# EAGLE design Adafruit Circuit Playground Bluefruit (EAGLE 9.5.0)

## Sheet 1 of 3
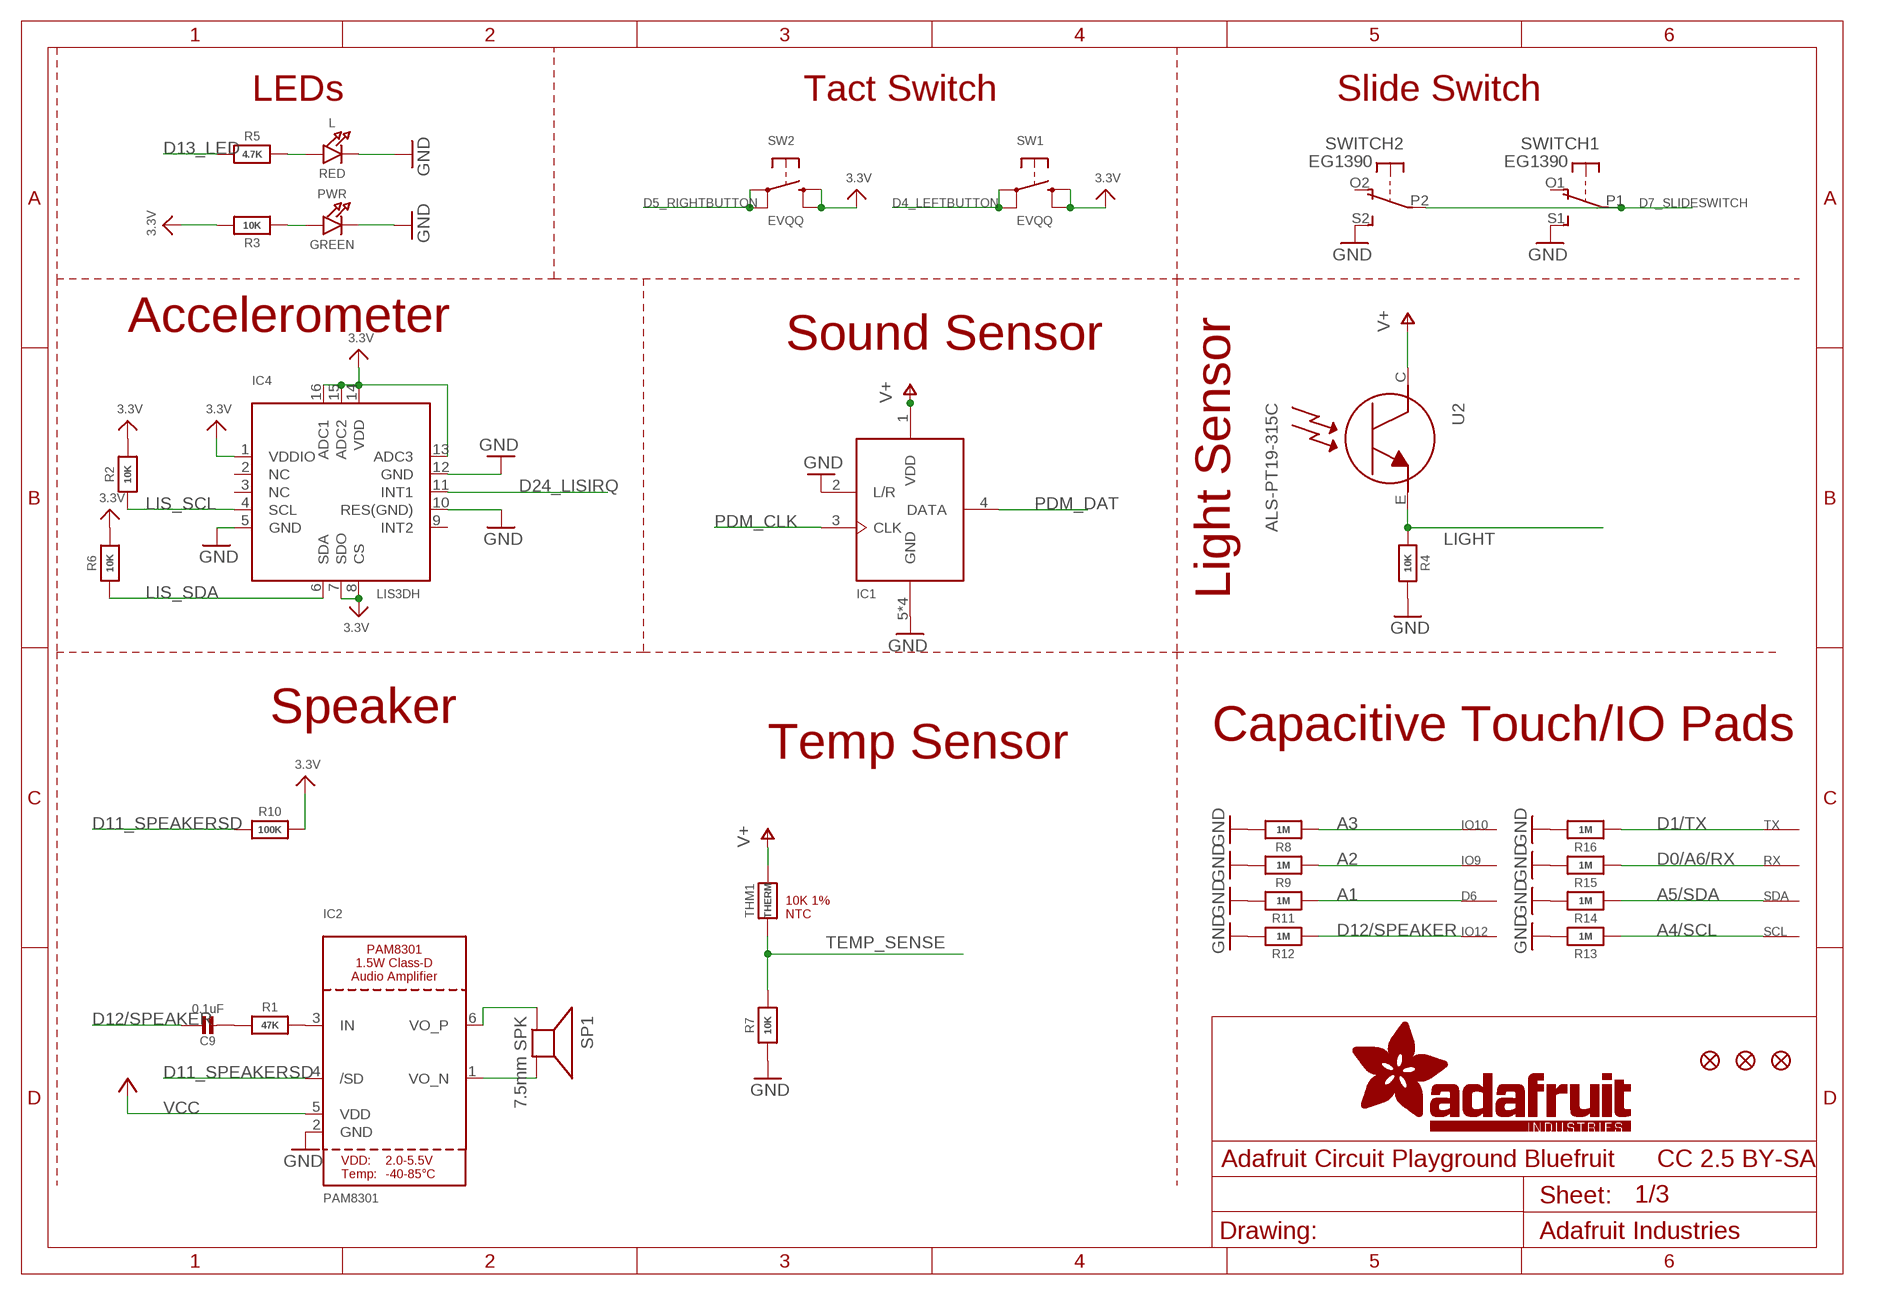
[diagram p0: schematic, sheet 1]

### Parts
C9  0.1uF  CAP_CERAMIC0603_NO  [0603-NO]
D6  SEWTAP-ALLIGATOR  [SEWALLI]
IC1  MIC_PDM  MIC_PDM_SPK0415  [SPK0415HM4H]
IC2  PAM8301  [SOT23-6]
IC4  LIS3DH  ACCEL_LIS3DHTR  [LGA16_3X3MM]
IO9  SEWTAP-ALLIGATOR  [SEWALLI]
IO10  SEWTAP-ALLIGATOR  [SEWALLI]
IO12  SEWTAP-ALLIGATOR  [SEWALLI]
L  RED  LED0603_NOOUTLINE  [CHIPLED_0603_NOOUTLINE]
PWR  GREEN  LED0603_NOOUTLINE  [CHIPLED_0603_NOOUTLINE]
R1  47K  RESISTOR_0603_NOOUT  [0603-NO]
R2  10K  RESISTOR_0603_NOOUT  [0603-NO]
R3  10K  RESISTOR_0603_NOOUT  [0603-NO]
R4  10K  RESISTOR_0603_NOOUT  [0603-NO]
R5  4.7K  RESISTOR_0603_NOOUT  [0603-NO]
R6  10K  RESISTOR_0603_NOOUT  [0603-NO]
R7  10K  RESISTOR_0603_NOOUT  [0603-NO]
R8  1M  RESISTOR_0603_NOOUT  [0603-NO]
R9  1M  RESISTOR_0603_NOOUT  [0603-NO]
R10  100K  RESISTOR_0603_NOOUT  [0603-NO]
R11  1M  RESISTOR_0603_NOOUT  [0603-NO]
R12  1M  RESISTOR_0603_NOOUT  [0603-NO]
R13  1M  RESISTOR_0603_NOOUT  [0603-NO]
R14  1M  RESISTOR_0603_NOOUT  [0603-NO]
R15  1M  RESISTOR_0603_NOOUT  [0603-NO]
R16  1M  RESISTOR_0603_NOOUT  [0603-NO]
RX  SEWTAP-ALLIGATOR  [SEWALLI]
SCL  SEWTAP-ALLIGATOR  [SEWALLI]
SDA  SEWTAP-ALLIGATOR  [SEWALLI]
SP1  7.5mm SPK  SPEAKER_7.5MM  [BUZZER_SMT_7.5MM]
SW1  EVQQ  SWITCH_TACT_SMT_EVQQ2_SMALL  [EVQ-Q2_SMALLER]
SW2  EVQQ  SWITCH_TACT_SMT_EVQQ2_SMALL  [EVQ-Q2_SMALLER]
SWITCH  EG1390  DPDT-EG1390  [EG1390]
THM1  THERM  RESISTOR_0402  [_0402]
TX  SEWTAP-ALLIGATOR  [SEWALLI]
U2  ALS-PT19-315C  PHOTOTRANSISTOR_PT19-315C  [ALS-PT19-315C]
U$2  FIDUCIAL_1MM  [FIDUCIAL_1MM]
U$3  FIDUCIAL_1MM  [FIDUCIAL_1MM]
U$6  FIDUCIAL_1MM  [FIDUCIAL_1MM]

### Nets
3.3V [power]: IC4.1(VDDIO) IC4.7(SDO) IC4.8(CS) IC4.13(ADC3) IC4.14(VDD) IC4.15(ADC2) IC4.16(ADC1) R2.2 R3.2 R6.2 R10.2 SW1.B'(S1) SW1.B(S) SW2.B'(S1) SW2.B(S) ; also sheet 2,3
A1: D6.P$1(SEW) R11.1 ; also sheet 2
A2: IO9.P$1(SEW) R9.1 ; also sheet 2
A3: IO10.P$1(SEW) R8.1 ; also sheet 2
A4/SCL: R13.1 SCL.P$1(SEW) ; also sheet 2
A5/SDA: R14.1 SDA.P$1(SEW) ; also sheet 2
D0/A6/RX: R15.1 RX.P$1(SEW) ; also sheet 2
D1/TX: R16.1 TX.P$1(SEW) ; also sheet 2
D4_LEFTBUTTON: SW1.A'(P1) SW1.A(P) ; also sheet 2
D5_RIGHTBUTTON: SW2.A'(P1) SW2.A(P) ; also sheet 2
D7_SLIDESWITCH: SWITCH.P1(1:P) SWITCH.P2(2:P) ; also sheet 2
D11_SPEAKERSD: IC2.4(/SD) R10.1 ; also sheet 2
D12/SPEAKER: C9.1 IO12.P$1(SEW) R12.1 ; also sheet 2
D13_LED: R5.1 ; also sheet 2
D24_LISIRQ: IC4.11(INT1) ; also sheet 2
GND [power]: IC1.2(L/R) IC1.5(GND) IC1.6(GND) IC1.7(GND) IC1.8(GND) IC2.2(GND) IC4.5(GND) IC4.10(RES(GND)) IC4.12(GND) L.C PWR.C R4.1 R7.1 R8.2 R9.2 R11.2 R12.2 R13.2 R14.2 R15.2 R16.2 SWITCH.S1(1:S) SWITCH.S2(2:S) ; also sheet 2,3
LIGHT: R4.2 U2.E ; also sheet 2
LIS_SCL: IC4.4(SCL) R2.1 ; also sheet 2
LIS_SDA: IC4.6(SDA) R6.1 ; also sheet 2
N$1: PWR.A R3.1
N$6: C9.2 R1.1
N$8: IC2.3(IN) R1.2
N$9: IC2.6(VO_P) SP1.+
N$10: L.A R5.2
N$15: IC2.1(VO_N) SP1.-
PDM_CLK: IC1.3(CLK) ; also sheet 2
PDM_DAT: IC1.4(DATA) ; also sheet 2
TEMP_SENSE: R7.2 THM1.1 ; also sheet 2
V+ [power]: IC1.1(VDD) THM1.2 U2.C ; also sheet 3
VCC: IC2.5(VDD) ; also sheet 3
Unconnected: IC4.2(NC) IC4.3(NC) IC4.9(INT2) SWITCH.O1(1:O) SWITCH.O2(2:O)

### Notes on the sheet
- LEDs | Tact Switch | Slide Switch
- Accelerometer
- Sound Sensor
- Light Sensor
- Speaker
- Capacitive Touch/IO Pads
- Temp Sensor
- 10K 1%
  NTC
- CC 2.5 BY-SA

## Sheet 2 of 3
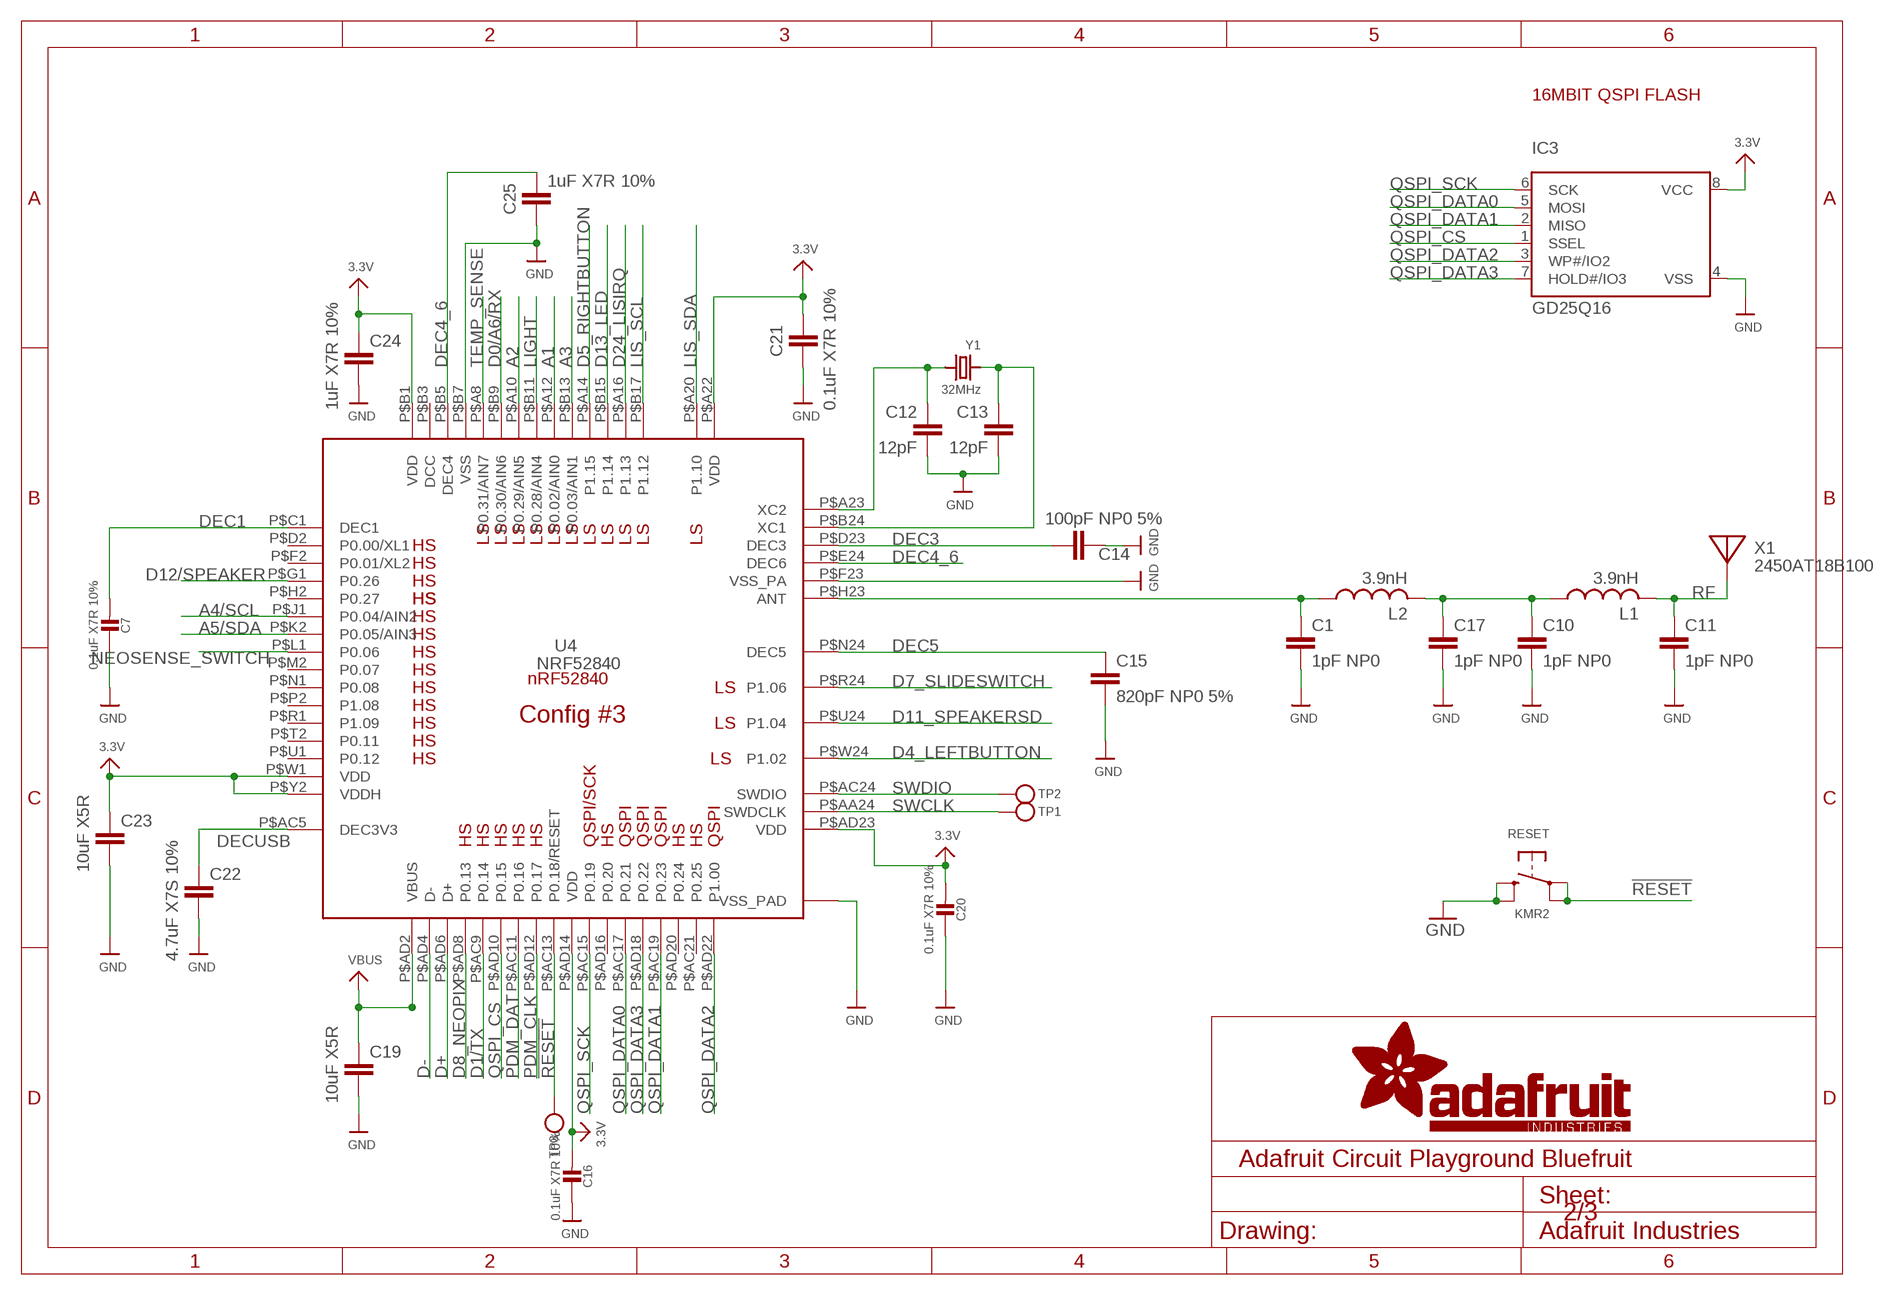
[diagram p1: schematic, sheet 2]

### Parts
C1  1pF NP0  CAPACITOR_0402_N  [RESC0402_N]
C7  0.1uF X7R 10%  CAP_CERAMIC0603_NO  [0603-NO]
C10  1pF NP0  CAPACITOR_0402_N  [RESC0402_N]
C11  1pF NP0  CAPACITOR_0402_N  [RESC0402_N]
C12  12pF  CAPACITOR_0402_N  [RESC0402_N]
C13  12pF  CAPACITOR_0402_N  [RESC0402_N]
C14  100pF NP0 5%  CAPACITOR_0402_N  [RESC0402_N]
C15  820pF NP0 5%  CAPACITOR_0402_N  [RESC0402_N]
C16  0.1uF X7R 10%  CAP_CERAMIC0603_NO  [0603-NO]
C17  1pF NP0  CAPACITOR_0402_N  [RESC0402_N]
C19  10uF X5R  CAPACITOR_0805_N  [RESC0805_N]
C20  0.1uF X7R 10%  CAP_CERAMIC0603_NO  [0603-NO]
C21  0.1uF X7R 10%  CAPACITOR_0603_L  [RESC0603_L]
C22  4.7uF X7S 10%  CAPACITOR_0805_N  [RESC0805_N]
C23  10uF X5R  CAPACITOR_0805_N  [RESC0805_N]
C24  1uF X7R 10%  CAPACITOR_0603_N  [RESC0603_N]
C25  1uF X7R 10%  CAPACITOR_0603_N  [RESC0603_N]
IC3  GD25Q16  SPIFLASH_8PINUX  [USON8]
L1  3.9nH  INDUCTOR_0402_N  [RESC0402_N]
L2  3.9nH  INDUCTOR_0402_N  [RESC0402_N]
RESET  KMR2  SWITCH_TACT_SMT4.6X2.8  [BTN_KMR2_4.6X2.8]
TP1  TESTPOINTROUND1.5MMNO  [TESTPOINT_ROUND_1.5MM_NO]
TP2  TESTPOINTROUND1.5MMNO  [TESTPOINT_ROUND_1.5MM_NO]
TP3  TESTPOINTROUND1.5MMNO  [TESTPOINT_ROUND_1.5MM_NO]
U4  NRF52840  NRF52840_CPB_SMALLCENTER  [AQFN50P700X800X85_HS-74N_SMALLCENTER]
X1  2450AT18B100  ANTENNA_JOHANSON_2450AT18B100  [ANT_2450AT18B100]
Y1  32MHz  CRYSTAL_2X1.6MM  [CRYSTAL_2X1.6]

### Nets
3.3V [power]: C16.2 C20.2 C21.1 C23.1 C24.1 IC3.8(VCC) U4.P$A22(VDD) U4.P$AD14(VDD) U4.P$AD23(VDD) U4.P$B1(VDD) U4.P$W1(VDD) U4.P$Y2(VDDH) ; also sheet 1,3
!RESET: RESET.A'(P1) RESET.A(P) TP3.P$1 U4.P$AC13(P0.18/RESET)
A1: U4.P$A12(P0.02/AIN0) ; also sheet 1
A2: U4.P$A10(P0.29/AIN5) ; also sheet 1
A3: U4.P$B13(P0.03/AIN1) ; also sheet 1
A4/SCL: U4.P$J1(P0.04/AIN2) ; also sheet 1
A5/SDA: U4.P$K2(P0.05/AIN3) ; also sheet 1
D0/A6/RX: U4.P$B9(P0.30/AIN6) ; also sheet 1
D1/TX: U4.P$AC9(P0.14) ; also sheet 1
D4_LEFTBUTTON: U4.P$W24(P1.02) ; also sheet 1
D5_RIGHTBUTTON: U4.P$A14(P1.15) ; also sheet 1
D7_SLIDESWITCH: U4.P$R24(P1.06) ; also sheet 1
D8_NEOPIX: U4.P$AD8(P0.13) ; also sheet 3
D11_SPEAKERSD: U4.P$U24(P1.04) ; also sheet 1
D12/SPEAKER: U4.P$G1(P0.26) ; also sheet 1
D13_LED: U4.P$B15(P1.14) ; also sheet 1
D24_LISIRQ: U4.P$A16(P1.13) ; also sheet 1
D+: U4.P$AD6(D+) ; also sheet 3
D-: U4.P$AD4(D-) ; also sheet 3
DEC1: C7.2 U4.P$C1(DEC1)
DEC3: C14.1 U4.P$D23(DEC3)
DEC4_6: C25.1 U4.P$B5(DEC4) U4.P$E24(DEC6)
DEC5: C15.1 U4.P$N24(DEC5)
DECUSB: C22.1 U4.P$AC5(DEC3V3)
GND [power]: C1.2 C7.1 C10.2 C11.2 C12.2 C13.2 C14.2 C15.2 C16.1 C17.2 C19.2 C20.1 C21.2 C22.2 C23.2 C24.2 C25.2 IC3.4(VSS) RESET.B'(S1) RESET.B(S) U4.P$B7(VSS) U4.P$F23(VSS_PA) U4.THERMPAD(VSS_PAD) ; also sheet 1,3
LIGHT: U4.P$B11(P0.28/AIN4) ; also sheet 1
LIS_SCL: U4.P$B17(P1.12) ; also sheet 1
LIS_SDA: U4.P$A20(P1.10) ; also sheet 1
N$2: C1.1 L2.1 U4.P$H23(ANT)
N$22: C12.1 U4.P$A23(XC2) Y1.3
N$23: C13.1 U4.P$B24(XC1) Y1.1
NEOSENSE_SWITCH: U4.P$L1(P0.06) ; also sheet 3
PDM_CLK: U4.P$AD12(P0.17) ; also sheet 1
PDM_DAT: U4.P$AC11(P0.16) ; also sheet 1
QSPI_CS: IC3.1(SSEL) U4.P$AD10(P0.15)
QSPI_DATA0: IC3.5(MOSI) U4.P$AC17(P0.21)
QSPI_DATA1: IC3.2(MISO) U4.P$AC19(P0.23)
QSPI_DATA2: IC3.3(WP#/IO2) U4.P$AD22(P1.00)
QSPI_DATA3: IC3.7(HOLD#/IO3) U4.P$AD18(P0.22)
QSPI_SCK: IC3.6(SCK) U4.P$AC15(P0.19)
RF: C11.1 L1.2 X1.FP
RF1: C10.1 C17.1 L1.1 L2.2
SWCLK: TP1.P$1 U4.P$AA24(SWDCLK)
SWDIO: TP2.P$1 U4.P$AC24(SWDIO)
TEMP_SENSE: U4.P$A8(P0.31/AIN7) ; also sheet 1
VBUS [power]: C19.1 U4.P$AD2(VBUS) ; also sheet 3
Unconnected: U4.P$AC21(P0.25) U4.P$AD16(P0.20) U4.P$AD20(P0.24) U4.P$B3(DCC) U4.P$D2(P0.00/XL1) U4.P$F2(P0.01/XL2) U4.P$H2(P0.27) U4.P$M2(P0.07) U4.P$N1(P0.08) U4.P$P2(P1.08) U4.P$R1(P1.09) U4.P$T2(P0.11) U4.P$U1(P0.12)

### Notes on the sheet
- 16MBIT QSPI FLASH
- Config #3

## Sheet 3 of 3
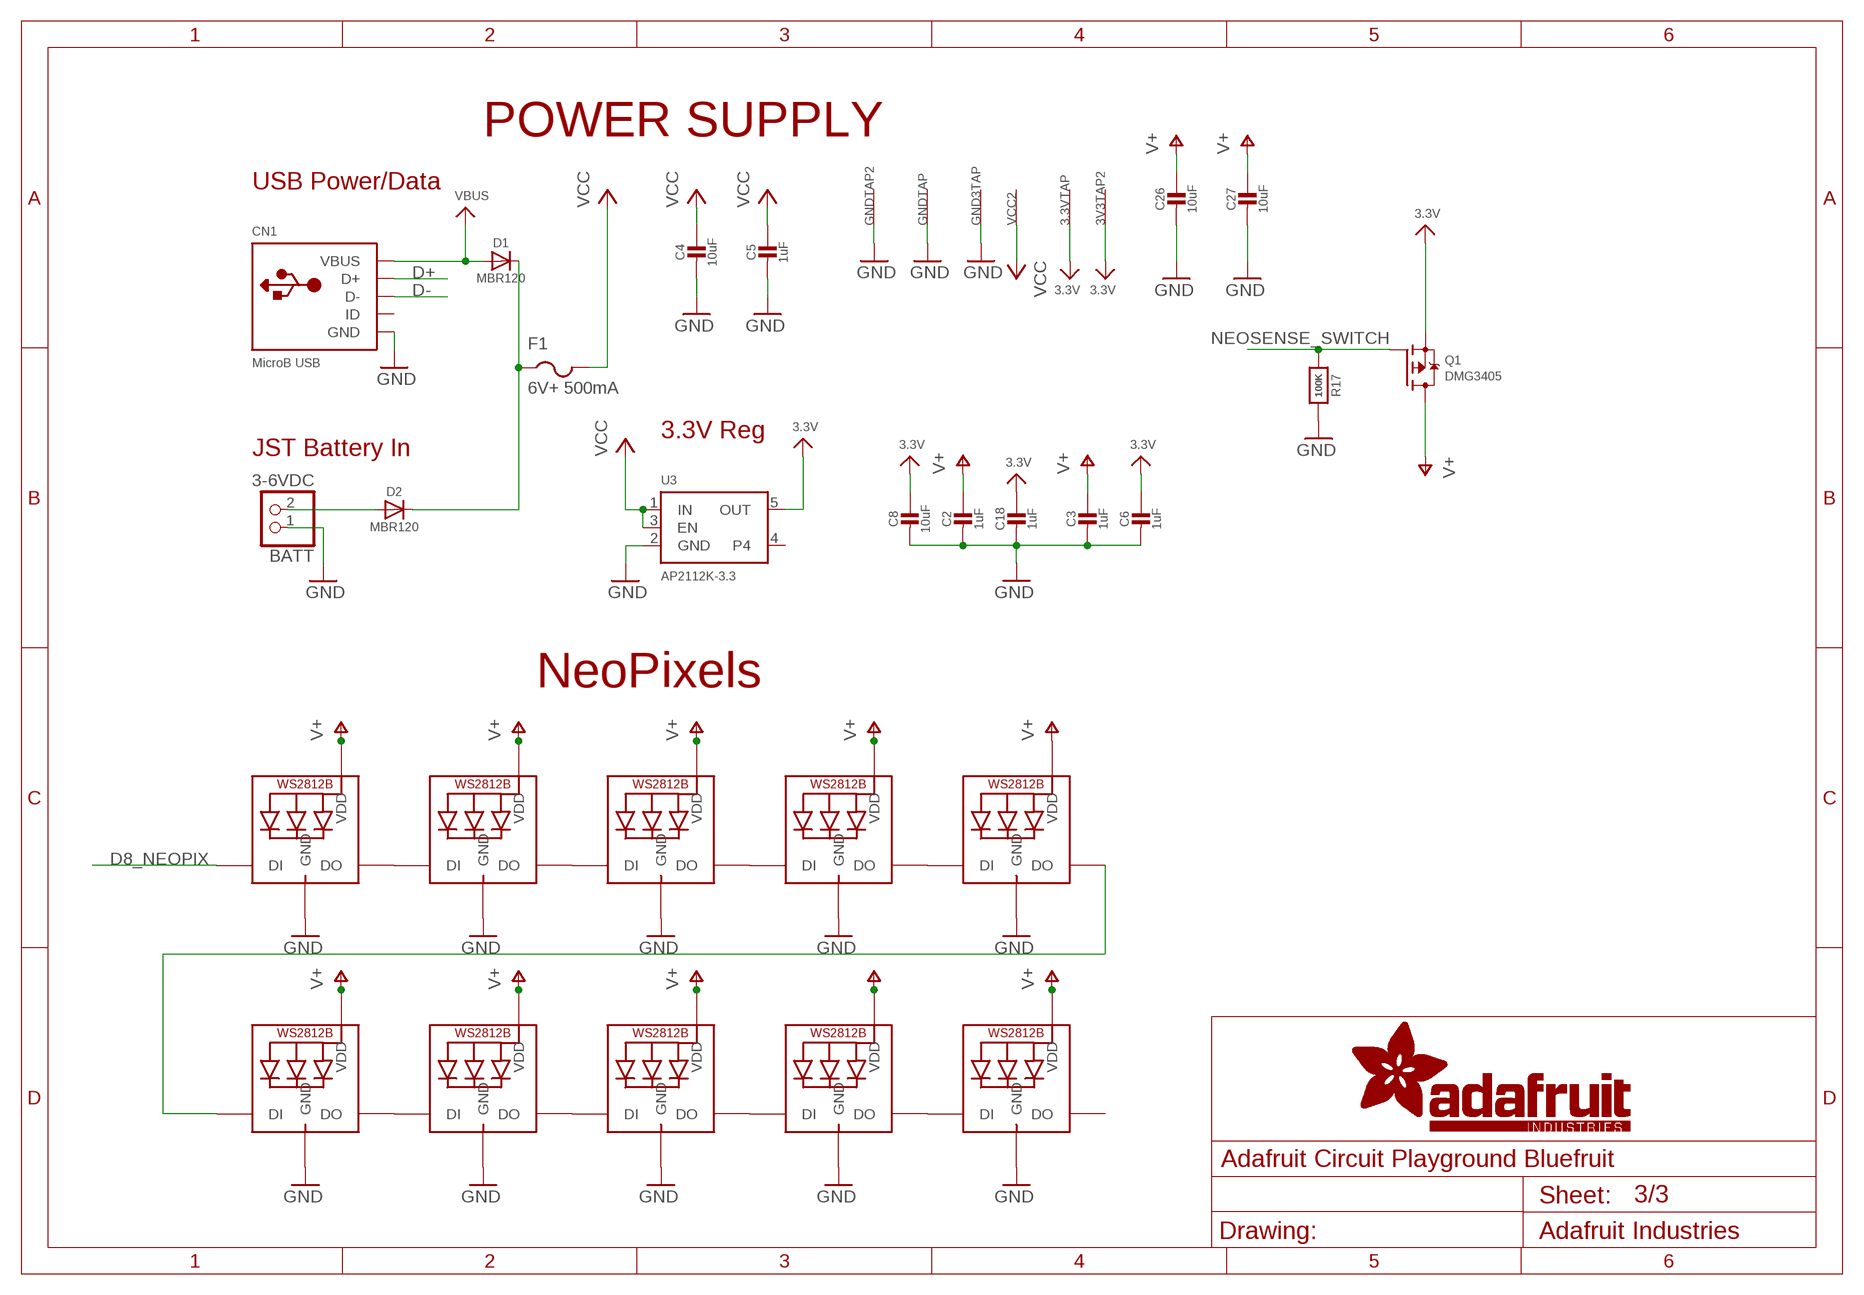
[diagram p2: schematic, sheet 3]

### Parts
3.3VTAP  SEWTAP-ALLIGATOR  [SEWALLI]
3V3TAP2  SEWTAP-ALLIGATOR  [SEWALLI]
BATT  3-6VDC  CON_JST_PH_2PIN  [JSTPH2]
C2  1uF  CAP_CERAMIC0603_NO  [0603-NO]
C3  1uF  CAP_CERAMIC0603_NO  [0603-NO]
C4  10uF  CAP_CERAMIC0805-NOOUTLINE  [0805-NO]
C5  1uF  CAP_CERAMIC0603_NO  [0603-NO]
C6  1uF  CAP_CERAMIC0603_NO  [0603-NO]
C8  10uF  CAP_CERAMIC0805-NOOUTLINE  [0805-NO]
C18  1uF  CAP_CERAMIC0603_NO  [0603-NO]
C26  10uF  CAP_CERAMIC0805-NOOUTLINE  [0805-NO]
C27  10uF  CAP_CERAMIC0805-NOOUTLINE  [0805-NO]
CN1  MicroB USB  USB_MICRO_20329_V2  [4UCONN_20329_V2]
D1  MBR120  DIODESOD-123  [SOD-123]
D2  MBR120  DIODESOD-123  [SOD-123]
F1  6V+ 500mA  PTCFUSE-1206  [R1206]
GND3TAP  SEWTAP-ALLIGATOR  [SEWALLI]
GNDTAP  SEWTAP-ALLIGATOR  [SEWALLI]
GNDTAP2  SEWTAP-ALLIGATOR  [SEWALLI]
LED1  WS2812B3535  [LED3535]
LED2  WS2812B3535  [LED3535]
LED3  WS2812B3535  [LED3535]
LED4  WS2812B3535  [LED3535]
LED5  WS2812B3535  [LED3535]
LED6  WS2812B3535  [LED3535]
LED7  WS2812B3535  [LED3535]
LED8  WS2812B3535  [LED3535]
LED9  WS2812B3535  [LED3535]
LED10  WS2812B3535  [LED3535]
Q1  DMG3405  MOSFET-P  [SOT23-R]
R17  100K  RESISTOR_0603_NOOUT  [0603-NO]
U3  AP2112K-3.3  VREG_SOT23-5  [SOT23-5]
VCC2  SEWTAP-ALLIGATOR  [SEWALLI]

### Nets
3.3V [power]: 3.3VTAP.P$1(SEW) 3V3TAP2.P$1(SEW) C6.1 C8.1 C18.1 Q1.2(S) U3.5(OUT) ; also sheet 1,2
D8_NEOPIX: LED6.1(DI) ; also sheet 2
D+: CN1.D+ ; also sheet 2
D-: CN1.D- ; also sheet 2
GND [power]: BATT.1 C2.2 C3.2 C4.2 C5.2 C6.2 C8.2 C18.2 C26.2 C27.2 CN1.BASE@1(GND) CN1.BASE@2(GND) CN1.GND CN1.SPRT@1(GND) CN1.SPRT@2(GND) CN1.SPRT@3(GND) CN1.SPRT@4(GND) GND3TAP.P$1(SEW) GNDTAP2.P$1(SEW) GNDTAP.P$1(SEW) LED1.4(GND) LED2.4(GND) LED3.4(GND) LED4.4(GND) LED5.4(GND) LED6.4(GND) LED7.4(GND) LED8.4(GND) LED9.4(GND) LED10.4(GND) R17.2 U3.2(GND) ; also sheet 1,2
N$3: D1.C D2.C F1.1
N$7: BATT.2 D2.A
N$11: LED1.1(DI) LED2.3(DO)
N$12: LED1.3(DO) LED3.1(DI)
N$13: LED2.1(DI) LED10.3(DO)
N$14: LED6.3(DO) LED7.1(DI)
N$16: LED7.3(DO) LED8.1(DI)
N$17: LED8.3(DO) LED9.1(DI)
N$18: LED9.3(DO) LED10.1(DI)
N$19: LED3.3(DO) LED4.1(DI)
N$20: LED4.3(DO) LED5.1(DI)
NEOSENSE_SWITCH: Q1.1(G) R17.1 ; also sheet 2
V+ [power]: C2.1 C3.1 C26.1 C27.1 LED1.2(VDD) LED2.2(VDD) LED3.2(VDD) LED4.2(VDD) LED5.2(VDD) LED6.2(VDD) LED7.2(VDD) LED8.2(VDD) LED9.2(VDD) LED10.2(VDD) Q1.3(D) ; also sheet 1
VBUS [power]: CN1.VBUS D1.A ; also sheet 2
VCC: C4.1 C5.1 F1.2 U3.1(IN) U3.3(EN) VCC2.P$1(SEW) ; also sheet 1
Unconnected: CN1.ID LED5.3(DO) U3.4

### Notes on the sheet
- POWER SUPPLY
- USB Power/Data
- 3.3V Reg
- JST Battery In
- NeoPixels

## Library data of the parts
3.3VTAP 3V3TAP2 D6 GND3TAP GNDTAP GNDTAP2 IO9 IO10 IO12 RX SCL SDA TX VCC2 = microbuilder:SEWTAP
BATT = microbuilder:CON_JST_PH_2PIN: JST 2-Pin Right-Angle Connector PH-Series - 4UConnector: 17311 SH-Series - 4UConnector: 07278
C1 C10-C15 C17 C19 C21-C25 = Nordic_misc:CAPACITOR: Generic chip capacitor
C2-C9 C16 C18 C20 C26 C27 = microbuilder:CAP_CERAMIC: Ceramic Capacitors For new designs, use the packages preceded by an '_' character since they are more reliable: The following footprints should be used on most boards: _0402 - Standard footprint for regular board layouts _0603 - Standard footprint for regular board layouts _0805 - Standard footprint for regular board layouts _1206 - Standard footprint for regular board layouts For extremely tight-pitch boards where space is at a premium, the following 'micro-pitch' footprints can be used (smaller pads, no silkscreen outline, etc.): _0402MP - Micro-pitch footprint for very dense/compact boards _0603MP - Micro-pitch footprint for very dense/compact boards _0805MP - Micro-pitch footprint for very dense/compact boards _1206MP - Micro-pitch footprint for very dense/compact boards
CN1 = microbuilder:USB: USB Connectors USBMINIB - Surface Mount Female Mini-B USB Connector 4UConnector: 06564
D1 D2 = microbuilder:DIODE: Diode SMA Model Volts Amps Type Vf Ir Digikey # Notes SSA34-E3 40V 3A Schottky 480mV @ 3A 200uA @ 40V SSA34-E3/61TGITR-ND CDBA120-G 20V 1A Schottky 500mV @ 1A 500uA @ 20V 641-1014-6-ND REEL MBRA210 10V 2A Schottky 350mV @ 2A 700uA @ 10V MBRA210LT3 SOD-123 Model Volts Amps Type Vf Ir Order # Notes BAT54T1G 30V 200mA Schottky 800mV @ 200mA 2uA @ 25V BAT54T1GOSTR-ND B0530W 30V 500mA Schottky 430mV @ 500mA 130uA @ 30V B0530W-FDICT-ND REEL MBR120 20V 1A Schottky 340mV @ 1A MBR120VLSFT1GOSCT-ND SOD-323 Model Volts Amps Type Vf Ir Order # Notes PMEG2005EJ 20V 500mA Schottky 355mV @ 500mA 568-4110-1-ND ZLLS410 10V 570mA Schottky 380mV @ 570mA ZLLS410CT-ND 1N4148WS 75V 150mA Silicon/Simple 1V 1N4148WSFSCT-ND REEL SOD-523 Model Volts Amps Type Vf Ir Order # Notes BAT54XV2 30V 200mA Schottky 0.8V @ 100mA BAT54XV2CT-ND TB751S 30V 30mA Schottky RB751S-40TE61CT-ND SOT23-R/W (R = Solder Paste/Reflow Ovens, W = Hand-Soldering) Model Volts Amps Type Vf Ir Order # Notes BAT54FILM 40V 300mA Schottky 497-7162-1-ND POWERDI-5 Model Volts Amps Type Vf Ir Order # Notes PDS560 60V 5A Schottky 670mV @ 5A 150uA @ 60V PDS560DICT-ND
F1 = adafruit:PTCFUSE: PTC fuses, resettable thermistors
IC1 = microbuilder:MIC_PDM
IC2 = microbuilder:PAM8301
IC3 = microbuilder:SPIFLASH_8PIN: SOIC8 SPI Flash Be careful with the size since SOIC8 flash comes in several 'widths' SOIC8 150 mil M25P16 - 16Mbit (2Mbit x 8) Serial Flash (75MHz SPI Bus), Supply: 2.7-3.6V Digikey: SOIC8 - M25P16-VMN6P-ND SOIC8 208 mil W25Q16BVSSIG - 16Mbit (2Mbit x 8) Serial Flash (104MHz SPI Bus), Supply: 2.7-3.6V Digikey: SOIC8 - W25Q16BVSSIG-ND
IC4 = microbuilder:ACCEL_LIS3DHTR: LIS3DHTR 3-Axis Accelerometer with I2C/SPI Interface VDD: 1.71-3.6V VDDIO: 1.71-VDD+0.1V Scale: +/-2g, 4g, 8g, 16g with 16--bit data output Temp:: -40°C - 85°C Mouser: 511-LIS3DHTR Digikey: 497-10613-1-ND
L PWR = microbuilder:LED: LED 0603 - 0603 Surface Mount Package 2mA: Green LED - Low Power (3.9mcd, 2ma, 1.7Vf) - Digikey: 475-2709-2-ND Orange LED - Low Power (9.8mcd, 2ma, 1.8Vf) - Digikey: 475-1194-2-ND Red LED - Low Power (5mcd, 2ma, 1.8Vf) - Digikey: 475-1195-2-ND Yellow LED - Low Power (7mcd, 2ma, 1.8Vf) - Digikey: 475-1196-2-ND 5mA: Blue LED - Low Power (17mcd, 5ma, 2.9Vf) - Digikey: LNJ937W8CRACT-ND 0805 - 0805 Surface Mount Package 2mA: Red LED (8.8mcd, 2mA, 1.8Vf, Clear) - Low Power [Digikey: 475-2510-1-ND] Green LED (5mcd, 2mA, 1.8Vf, Clear) - Low Power [Digikey: 475-2730-1-ND] Yellow LED (11.3mcd, 2mA, 1.8Vf, Clear) - Low Power [Digikey: 475-2555-1-ND] 20mA: Red LED (104mcd, 20mA, Diffused) - LS R976 [Digikey: 475-1278-6-ND] Red LED (12mcd, 20mA, 2.0Vf, Clear) - APT2012EC [Digikey: 754-1128-1-ND] Green LED (15mcd, 20mA, 2.2Vf, Clear) - APT2012GC [Digikey: 754-1131-1-ND] Orange LED (160mcd, 20mA, 2.1Vf, Clear) - APT2012SECK [Digikey: 754-1130-1-ND] 1206 - 1206 Surface Mount Package Green LED (26mcd, 20mA, Diffused) - LG N971 [Digikey: 475-1407-6-ND] Red LED (15mcd, 20mA, Diffused) - LH N974 [Digikey: 475-1416-6-ND] Cree - Cree High-Power Surface Mount LEDs XPEBWT-L1-0000-00D50 - White 111lm 350mA 2.9Vf 6200K 110° XTEAWT-00-0000-00000LEE3 - White 114lm 350mA 2.85Vf 5000K 115° Everlight - Everlight 45-21 Series Surface Mount LEDs 45-21/QK2C-B2832AC2CB2/2T - Warm White 2000mcd 20mA 3.25Vf 3050K 120° 45-21/LK2C-B38452C4CB2/2T - Nuetral White 2000mcd 20mA 3.25Vf 4150K 120° 45-21/LK2C-B50634C6CB2/2T - Cold White 2200mcd 20mA 3.25Vf 5650K 120° PLCC2 Reverse Mount LS T77K-J1L2-1-0-2-R18-Z - Red 11.25mcd 2mA 1.8Vf 630nm 120° LO T77K-L1M2-24-Z - Orange 19.6mcd 2mA 1.8Vf 606nm 120° LY T77K-K2M1-26-Z - Yellow 15.7mcd 2mA 1.8Vf 587nm 120°
L1 L2 = Nordic_misc:INDUCTOR: Generic chip inductor
LED1-LED10 = microbuilder:WS2812B
Q1 = microbuilder:MOSFET-P: P-Channel Mosfet LEGEND VDS: Voltage Drain-Source ID: Drain Current RDS(ON): Drain-Source On-State Resistance VGS(TH): Gate-Source Threshold Voltage CISS: Drain-Source Input Capacitance SOT-23 Name VDS ID RDS(ON) VGS(TH) CISS Order Number IRLML5103 30V 760mA 600 mOhm -- 75pF @ 25V Digikey: IRLML5103PBFCT-ND IRLML6401 12V 4.3A 50 mOhm 950mV @ 250µA 830pF @ 10V Digikey: IRLML6401PBFTR-ND NTR0202PL 20V 400mA 800 mOhm 2.3V @ 250uA 70pF @ 5V Digikey: NTR0202PLT1GOSTR-ND NTR4101PT1G 20V 1.8A 85 mOhm 1.2V @ 250uA 675pF @ 10V Digikey: NTR4101PT1GOSCT-ND DMP2004K 20V 600mA 900 mOhm 1V @ 250uA 175pF @ 16V Digikey: DMP2004KDICT-ND PMV65XP 20V 3.9A 76 mOhm 950mV @ 1mA 725pF @ 20V Digikey: 568-2358-2-ND TO-252 Name VDS ID RDS(ON) VGS(TH) CISS Order Number AOD417 30V 25A 34 mOhm 3V @ 250µA 920pF @ 15V Digikey: 785-1106-2-ND PowerPak Name VDS ID RDS(ON) VGS(TH) CISS Order Number AON7401 30V 12A 14 mOhm 3V @ 250µA 2600pF @ 15V Digikey: 785-1302-1-ND
R1-R17 THM1 = microbuilder:RESISTOR: Resistors For new designs, use the packages preceded by an '_' character since they are more reliable: The following footprints should be used on most boards: _0402 - Standard footprint for regular board layouts _0603 - Standard footprint for regular board layouts _0805 - Standard footprint for regular board layouts _1206 - Standard footprint for regular board layouts For extremely tight-pitch boards where space is at a premium, the following 'micro-pitch' footprints can be used (smaller pads, no silkscreen outline, etc.): _0402MP - Micro-pitch footprint for very dense/compact boards _0603MP - Micro-pitch footprint for very dense/compact boards _0805MP - Micro-pitch footprint for very dense/compact boards _1206MP - Micro-pitch footprint for very dense/compact boards
RESET SW1 SW2 = microbuilder:SWITCH_TACT_SMT: SMT Tact Switches 6x6mm - Digikey: P12940SCT-ND KMR2 (4.6x2.8mm) - Digikey: 401-1426-1-ND EVQ-PQHB55 - Light Touch, 160GF (4.5x4.5mm) - Digikey: P8090SCT-ND KMT0 - KMT021 NGJ LHS (etc.) IP68/Waterproof - Digikey: CKN10289CT-ND
SP1 = microbuilder:SPEAKER: SPEAKER Source: Buerklin Added PS12 (for part # PS1240 piezo) http://www.ladyada.net/library/pcb/eaglelibrary.html
SWITCH = adafruit:DPDT
TP1-TP3 = microbuilder:TESTPOINT: Test Point Various test points for characterisation and PCB testing TESTPOINT_SMT - Compact Surface Mount Test Point [Digikey: 5016KTR-ND]
U2 = microbuilder:PHOTOTRANSISTOR: ALS-PT19-315C - Analog Light Sensor VCC: 2.5-5.5V
U3 = microbuilder:VREG_SOT23-5: SOT23-5 Fixed Voltage Regulators Part Current Out V Out V In V Dropout θJA (°C/W) TJ (°C) Digikey Part No. ADP121 150mA 3.3V 3.4-5.5V 0.09V @ 150mA -- -- ADP121-AUJZ33R7CT-ND ADP121 150mA 3.0V 3.1-5.5V 0.09V @ 150mA -- -- ADP121-AUJZ30R7CT-ND ADP122 300mA 3.3V 3.4-5.5V 0.085V @ 300mA -- -- ADP122AUJZ-3.3-R7CT-ND ADP1712 300mA 3.3V 3.5-5.5V 0.17V @ 300mA -- -- ADP1712AUJZ-3.3-R7TR-ND AP7311 (Low Cost) 150mA 3.3V 3.5-6V 0.15V @ 150mA -- -- AP7311-33WG-7DICT-ND LD39015M18R 150mA 1.8V 1.9V-5.5V 0.08V @ 100mA -- -- 497-6977-1-ND LP2985A-33DBVR 150mA 3.3V 3.3-16V 0.28V @ 150mA 206 150 296-18479-1-ND MCP1824T-3302E/OT 300mA 3.3V 3.5V-6V 0.2V @ 300mA -- -- MCP1824T-3302E/OTCT-ND MIC5205-2.5YM5 TR 150mA 2.5V 2.7-16V 0.165V @ 150mA -- -- 576-1257-2-ND MIC5205-3.0YM5 TR 150mA 3.0V 3.2V-16V 0.165V @ 150mA -- -- 576-1258-2-ND MIC5205-3.3YM5 TR 150mA 3.3V 3.5V-16V 0.165V @ 150mA -- -- 576-1259-2-ND TPS780330220 150mA 3.3V+2.2V 3.6-5.5V 250mV Max -- -- 296-23332-1-ND TDA3663/N1,135 100mA 3.3V 3.5-45V 0.18V @ 50mA -- -- 568-5343-1-ND Max operating temp can be calculated using θJA, TJ (max junction temperature), and power in watts. Set the "Maximum Ambient Temperature" until it reaches TJ ("Max Junction Temperature"), which is the absolute limit for safe use of the regulator: Heat Sink Temperature Calculator <http://www.daycounter.com/Calculators/Heat-Sink-Temperature-Calculator.phtml> For example, With 12V source into a 3.3V LP2985 and a 30mA load, we are dissipating (12V-3.3V) * 0.03A = 0.261W. With a θJA of 206 °C/W, a TJ of 150°C, and 261mW we can safely use the chip without a heat sink up to 75°C (=147.1°C Junction Temperature).
U4 = adafruit_micro:NRF52840_CPB: nRF52840 Features Advanced Single chip 2.4 GHz multi-protocol SoC 32-bit ARM Cortex-M4F Processor 1.7v to 5.5v operation 1MB flash + 256kB RAM Bluetooth 5 support for long range and high throughput 802.15.4 radio support On-chip NFC PPI –Programmable Peripheral Interconnect Automated power management system with automatic power management of each peripheral Configurable I/O mapping for analog and digital I/O 48 x GPIO 1 x QSPI 4 x Master/Slave SPI 2 x Two-wire interface (I²C) I²S interface 2 x UART 4 x PWM USB 2.0 controller ARM TrustZone CryptoCell-310 Cryptographic and security module AES 128-bit ECB/CCM/AAR hardware accelerator Digital microphone interface (PDM) Quadrature decoder 12-bit ADC Low power comparator On-chip 50Ω balun On-air compatible with nRF52, nRF51 and nRF24 Series Applications Advanced high performance wearables Wearables for secure payments Virtual Reality/Augmented Reality systems Smart Home sensor networks Smart city sensor networks High performance HID controllers Internet of Things (IoT) sensor networks Smart door locks Smart lighting networks Connected white goods
U$2 U$3 U$6 = microbuilder:FIDUCIAL: Fiducial Alignment Points Various fiducial points for machine vision alignment.; BOM: EXCLUDE
X1 = adafruit_wireless:ANTENNA_JOHANSON_2450AT18B100: Johanson 2.4GHz Chip Antenna (1206 Package) Frequency Range: 2400 - 2500 Mhz Peak Gain 0.5 dBi typ. (XZ-V) Average Gain -0.5 dBi typ. (XZ-V) Input Power 3W max. Operating Temperature -40 to +85°C Digikey: 712-1006-1-ND
Y1 = microbuilder:CRYSTAL: Crystals HC49UP - Surface Mount Crystal 4.0MHz 18pF +/-30ppm Surface Mount Crystal [Digikey: 535-9857-1-ND] 12.0 MHz Surface Mount Crystal [Digikey: 535-9869-6-ND] 25.0 MHz Surface Mount Crystal [Digikey: 535-9078-1-ND] 2.5 x 2.0mm - MEMs SMT Crystal 16.0 MHz 10pF 20ppm 2.5 x 2.0mm Crystal [Digikey -40-85°C: 535-10923-1-ND] 3.2 x 2.5mm - MEMs SMT Crystal 12.0 MHz 8pF 15ppm 3.2 x 2.5mm Crystal [Digikey: -10-70°C: 644-1047-1-ND -40-125°C: 644-1128-1-ND] 40~85°C cheaper: 644-1173-6-ND 16.0 MHz 8pF 15ppm 3.2 x 2.5mm Crystal [Digikey: -10-70°C: 644-1049-1-ND -40-125°C: 644-1129-2-ND]-40~85°C cheaper: 644-1175-6-ND 16.0 MHz 10pF 10ppm 3.2 x 2.5mm Crystal [Digikey: 644-1100-1-ND] 27.12 MHz 18pF 30ppm 3.2 x 2.5mm Crystal [Digikey: 887-1424-1-ND] 27.12MHz 10pF 10ppm 3.2 x 2.5mm Crystal [Digikey: 887-1329-1-ND] 4.9 x 1.8mm - MEMs SMT Crystal 32.768 KHz 12.5pF 20ppm 4.9 x 1.8mm Crystal [Digikey: SE2415CT-ND] 8.0 x 3.8mm - Surface Mount Crystal 32.768kHz 12.5pF 20ppm -40°C-85°C [Digikey: 535-9166-2-ND] Cylinder 32.768KHz Cylinder Crystal (2x6mm body) [Ex. Digikey: 300-8341-2-ND]

## Net classes
0 default: width 0.178 mm
1 power: width 0.254 mm

## Board
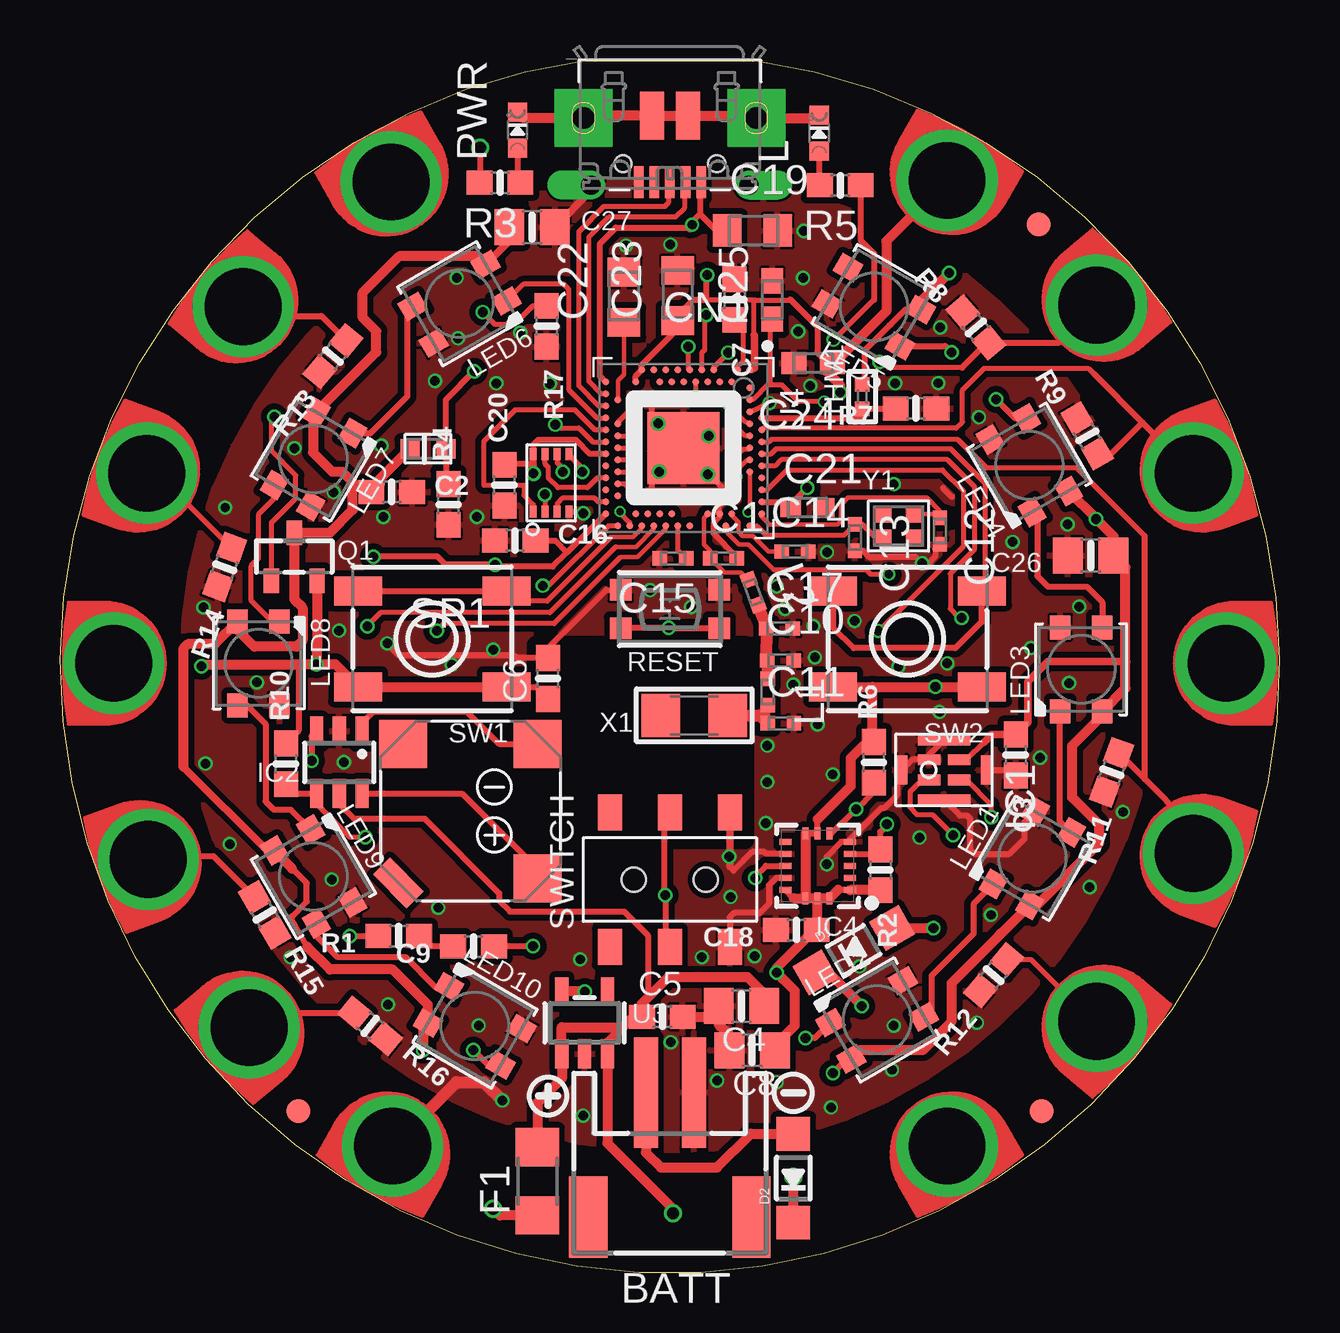
[diagram p3: board, top side]
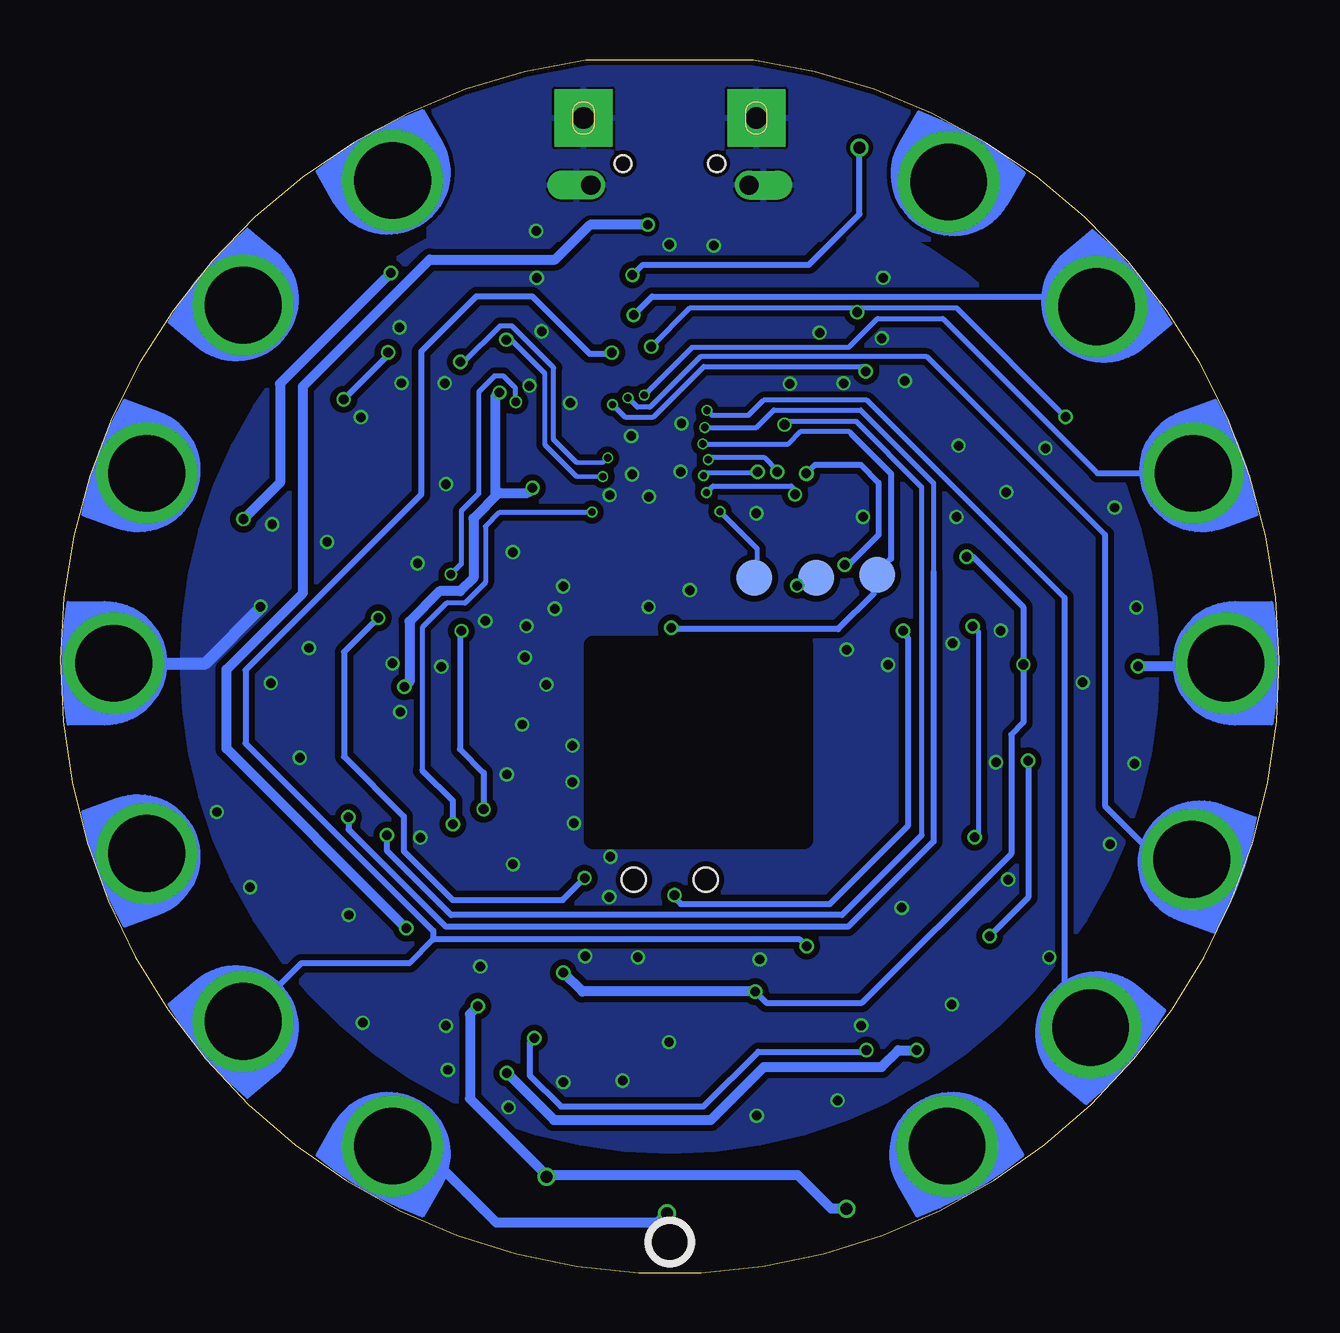
[diagram p4: board, bottom side, seen from below]

Size 50.82 x 50.55 mm. Coordinates in mm from the lower left corner, seen from the top.
Outline: 21.92,50.55 28.9,50.55 arc-344 21.92,50.55
Copper layers (1*16): Top 0.035mm / dielectric 0.2mm / Bottom 0.035mm
Design rules "bluefruit *": minimum track width 7mil, minimum drill 10mil, track to track 7mil, track to pad 7mil, pad to pad 7mil, via to via 7mil, smd to smd 6mil, copper to edge 8mil, drill to drill 12mil, minimum pad ring 3mil, minimum via ring 3mil, stop-mask expansion 0.05mm, vias tented up to drill 20mil, thermal gap 4mil
tRestrict: area 19.8,18 to 28.5,26.2; area 28.7,29.5 to 28.8,30
bRestrict: area 19.8,18 to 28.6,26.2

### Footprints (pad centres in the part's own frame; a part is rotated, then mirrored left to right if it is on the bottom)
SEWALLI = drill 3.2: P$1 0,0.508
JSTPH2 = smd 1 x 4.6: 1 -1,-3.7; 2 1,-3.7 | smd 1.6 x 3.4: NC1 -3.4,1.5; NC2 3.4,1.5
RESC0402_N = smd 0.6 x 0.6: 1 -0.55,0; 2 0.55,0
0603-NO = smd 1.075 x 1: 1 -0.85,0; 2 0.85,0
0805-NO = smd 1.24 x 1.5: 1 -0.95,0; 2 0.95,0
RESC0805_N = smd 1.2 x 1.35: 1 -1.1,0; 2 1,0
RESC0603_L = smd 0.85 x 0.8: 1 -0.7,0; 2 0.7,0
RESC0603_N = smd 1.05 x 0.9: 1 -0.8,0; 2 0.8,0
4UCONN_20329_V2 = smd 1 x 2: BASE@1 -0.75,-2; BASE@2 0.75,-2 | smd 0.4 x 1.35: D+ 0,0.775; D- -0.65,0.775; GND 1.3,0.775; ID 0.65,0.775; VBUS -1.3,0.775 | drill 0.8 pad 1.143 offset: SPRT@1 -3.3,0.9; SPRT@2 3.3,0.9 | drill 0.9 pad 2.413 square: SPRT@3 -3.6,-1.9; SPRT@4 3.6,-1.9 | hole 0.7: -1.95,0; 1.95,0
SOD-123 = smd 1.4 x 1.4: A 1.85,0; C -1.85,0
R1206 = smd 1.6 x 1.803: 1 -1.422,0; 2 1.422,0
SPK0415HM4H = smd 0.45 x 0.95: 1 0.425,-0.625; 2 0.425,0.625; 3 -0.425,0.625; 4 -0.425,-0.625 | smd 1.2 x 0.45: 5 0,-1.75; 7 0,1.75 | smd 0.45 x 2.2: 6 1.25,0; 8 -1.25,0
SOT23-6 = smd 0.55 x 1.2: 1 -0.95,-1.3; 2 0,-1.3; 3 0.95,-1.3; 4 0.95,1.3; 5 0,1.3; 6 -0.95,1.3
USON8 = smd 0.5 x 0.275: 1 -1.2,0.75; 2 -1.2,0.25; 3 -1.2,-0.25; 4 -1.2,-0.75; 5 1.2,-0.75; 6 1.2,-0.25; 7 1.2,0.25; 8 1.2,0.75
LGA16_3X3MM = smd 0.5 x 0.25: 1 -1.35,1; 2 -1.35,0.5; 3 -1.35,0; 4 -1.35,-0.5; 5 -1.35,-1; 9 1.35,-1; 10 1.35,-0.5; 11 1.35,0; 12 1.35,0.5; 13 1.35,1 | smd 0.25 x 0.5: 6 -0.5,-1.35; 7 0,-1.35; 8 0.5,-1.35; 14 0.5,1.35; 15 0,1.35; 16 -0.5,1.35
CHIPLED_0603_NOOUTLINE = smd 0.8 x 0.8: A 0,-0.75; C 0,0.75
LED3535 = smd 1 x 0.85: 1 -1.75,0.875; 2 -1.75,-0.875; 3 1.75,-0.875; 4 1.75,0.875
SOT23-R = smd 0.635 x 1.016: 1 -0.95,-1; 2 0.95,-1; 3 0,1
BTN_KMR2_4.6X2.8 = smd 0.9 x 0.9: A 2.05,0.8; A' -2.05,0.8; B 2.05,-0.8; B' -2.05,-0.8
BUZZER_SMT_7.5MM = smd 2 x 2: + 2.8,-2.8; - 2.8,2.8; MT2 -2.8,2.8 | smd 2 x 1 rotated 135: MT -3,-3
EVQ-Q2_SMALLER = smd 2 x 1.2: A -3.1,-2; A' 3.1,-2; B -3.1,2; B' 3.1,2
EG1390 = smd 1 x 1.5: O1 -2.5,2.8; O2 -2.5,-2.8; P1 0,2.8; P2 0,-2.8; S1 2.5,2.8; S2 2.5,-2.8 | hole 1: 1.5,0; -1.5,0
_0402 = smd 0.6 x 0.6: 1 -0.508,0; 2 0.508,0
TESTPOINT_ROUND_1.5MM_NO = smd 1.5 x 1.5: P$1 0,0
ALS-PT19-315C = smd 0.8 x 0.8: C -0.75,0; E 0.75,0
SOT23-5 = smd 0.55 x 1.2: 1 -0.95,-1.3; 2 0,-1.3; 3 0.95,-1.3; 4 0.95,1.3; 5 -0.95,1.3
AQFN50P700X800X85_HS-74N_SMALLCENTER = smd 0.3 x 0.3: P$A8 -1.25,3.25; P$A10 -0.75,3.25; P$A12 -0.25,3.25; P$A14 0.25,3.25; P$A16 0.75,3.25; P$A18 1.25,3.25; P$A20 1.75,3.25; P$A22 2.25,3.25; P$A23 2.75,3.25; P$AA24 3.25,-2.25; P$AC5 -2,-2.75; P$AC9 -1,-2.75; P$AC11 -0.5,-2.75; P$AC13 0,-2.75; P$AC15 0.5,-2.75; P$AC17 1,-2.75; P$AC19 1.5,-2.75; P$AC21 2,-2.75; P$AC24 3.25,-2.75; P$AD2 -2.75,-3.25; P$AD4 -2.25,-3.25; P$AD6 -1.75,-3.25; P$AD8 -1.25,-3.25; P$AD10 -0.75,-3.25; P$AD12 -0.25,-3.25; P$AD14 0.25,-3.25; P$AD16 0.75,-3.25; P$AD18 1.25,-3.25; P$AD20 1.75,-3.25; P$AD22 2.25,-3.25; P$AD23 2.75,-3.25; P$B1 -3.25,2.75; P$B3 -2.5,2.75; P$B5 -2,2.75; P$B7 -1.5,2.75; P$B9 -1,2.75; P$B11 -0.5,2.75; P$B13 0,2.75; P$B15 0.5,2.75; P$B17 1,2.75; P$B24 3.25,2.75; P$C1 -3.25,2.25; P$D2 -2.75,2; P$D23 2.75,2; P$E24 3.25,1.75; P$F2 -2.75,1.5; P$F23 2.75,1.5; P$G1 -3.25,1.25; P$H2 -2.75,1; P$H23 2.75,1; P$J1 -3.25,0.75; P$K2 -2.75,0.5; P$L1 -3.25,0.25; P$L24 3.25,0.25; P$M2 -2.75,0; P$N1 -3.25,-0.25; P$N24 3.25,-0.25; P$P2 -2.75,-0.5; P$P23 2.75,-0.5; P$R1 -3.25,-0.75; P$R24 3.25,-0.75; P$T2 -2.75,-1; P$T23 2.75,-1; P$U1 -3.25,-1.25; P$U24 3.25,-1.25; P$V23 2.75,-1.5; P$W1 -3.25,-1.75; P$W24 3.25,-1.75; P$Y2 -2.75,-2; P$Y23 2.75,-2 | smd 3 x 3: THERMPAD 0,0
FIDUCIAL_1MM = smd 1 x 1: 1 0,0
ANT_2450AT18B100 = smd 1.6 x 1.8: FP -1.4,0; NC 1.4,0
CRYSTAL_2X1.6 = smd 0.75 x 0.7: 1 -0.675,-0.5; 2 0.675,-0.5; 3 0.675,0.5; 4 -0.675,0.5

### Placement (x,y rotation side)
3.3VTAP  2.74,25.4 90 top
3V3TAP2  36.71,45.09 330 top
BATT  25.41,3.81 180 top
C1  27.64,29.77 0 top
C2  13.82,32.55 0 top
C3  39.82,21.58 270 top
C4  28.39,11.11 180 top
C5  25.09,10.67 0 top
C6  20.33,24.77 90 top
C7  28.1,40.56 270 top
C8  28.84,9.27 180 top
C9  17.23,13.6 180 top
C10  30.02,25.51 0 top
C11  30.03,22.9 0 top
C12  36.66,30.91 270 top
C13  33.12,30.64 270 top
C14  30.63,30.06 0 top
C15  25.54,29.77 180 top
C16  18.96,30.51 0 top
C17  29.98,26.85 0 top
C18  30.68,14.29 180 top
C19  28.9,43.43 0 top
C20  18.51,32.82 90 top
C21  31.15,31.89 0 top
C22  23.49,40.71 90 top
C23  25.73,40.78 90 top
C24  31.38,37.91 180 top
C25  29.68,40.54 90 top
C26  42.95,29.89 180 top
C27  19.67,43.58 0 top
CN1  25.41,46.23 180 top
D1  33.07,13.44 30 top
D2  30.55,3.94 90 top
D6  46.75,17.65 250 top
F1  19.89,3.81 90 top
GND3TAP  14.04,45.02 30 top
GNDTAP  48.08,25.4 270 top
GNDTAP2  14.11,5.72 150 top
IC1  36.84,20.96 90 top
IC2  11.63,21.27 180 top
IC3  20.46,32.92 90 top
IC4  31.57,16.95 180 top
IO9  46.75,33.15 290 top
IO10  42.81,40.01 310 top
IO12  42.81,10.8 230 top
L  31.63,47.5 0 top
L1  29.49,24.21 270 top
L2  28.88,28.36 290 top
LED1  40.52,17.27 60 top
LED2  34.05,10.54 30 top
LED3  42.55,25.15 90 top
LED4  40.4,33.66 120 top
LED5  33.92,40.26 150 top
LED6  16.65,40.39 210 top
LED7  10.55,33.91 240 top
LED8  8.26,25.4 270 top
LED9  10.55,16.51 300 top
LED10  17.28,10.29 330 top
PWR  19.06,47.63 0 top
Q1  9.75,29.85 0 top
R1  14.11,14.03 180 top
R2  34.18,16.79 270 top
R3  18.32,45.43 180 top
R4  16.18,32.02 90 top
R5  32.51,45.32 180 top
R6  33.92,21.27 90 top
R7  35.67,36.03 180 top
R8  38.16,39.41 130 top
R9  42.81,34.87 120 top
R10  9.41,21.21 90 top
R11  43.82,20.85 250 top
R12  38.9,12.4 230 top
R13  11.36,38.2 230 top
R14  6.85,29.41 250 top
R15  8.52,14.91 300 top
R16  12.91,10.28 320 top
R17  20.27,39.45 270 top
RESET  25.41,27.66 180 top
RX  4.14,17.4 110 top
SCL  8.01,39.94 50 top
SDA  4.07,33.15 70 top
SP1  17.09,19.24 0 top
SW1  15.5,26.42 180 top
SW2  35.32,26.42 180 top
SWITCH  25.41,16.38 0 top
THM1  33.43,36.52 90 top
TP1  21.9,28.96 270 bottom
TP2  19.31,28.96 270 bottom
TP3  16.77,29.08 270 bottom
TX  8.26,10.54 130 top
U2  15.33,34.34 0 top
U3  21.85,10.41 0 top
U4  25.98,34.38 270 top
U$1  [SYMBOL_MINUS]  30.55,7.49 0 top
U$2  40.78,43.69 0 top
U$3  9.92,6.73 0 top
U$6  40.9,6.73 0 top
U$7  [PCBFEAT-REV-040]  25.41,1.27 0 bottom
U$16  [CPLAY_BLUEFRUIT_BOT]  50.81,0 0 bottom
U$35  [SYMBOL_PLUS]  20.33,7.37 0 top
U$44  [CPLAY_BLUEFRUIT_TOP]  0.01,0 0 top
VCC2  36.71,5.72 210 top
X1  26.43,23.23 180 top
Y1  34.94,31.13 0 top

### Tracks (layer width: path | path; a pad name or v marks a point on that pad's centre or on a via)
3.3V  (via drill 0.39, 0.4, 0.4 pad 0.64, 0.5)
  Top 0.203: 28.92,39.07 28.92,40.5 | 28.92,40.5 28.97,40.54 30.4,40.54 | 26.93,40.55 28.87,40.55 28.92,40.5
  Top 0.254: 28.93,37.71 28.86,37.63 U4.P$B1 | R10.2 9.93,22.59 9.93,25.23 9.82,25.35 | C24.1 32,37.91 31.56,38.35 31.56,39.43 30.43,40.56 30.4,40.54 | 26.93,40.55 26.93,40.56 | 26.93,40.56 26.93,41.55 v26.97,41.58 | 32.42,15.96 IC4.1 32.93,15.94 | IC4.13 30.57,15.6 | IC4.8 IC4.7 31.57,18.89 | 33.63,22.12 R6.2 33.85,22.19 | SW1.B 19.83,24.42 C6.1 | U4.P$Y2 23.98,37.38 U4.P$W1 24.23,37.83 25.73,39.34 C23.1 25.73,39.91 26.39,40.56 26.93,40.56 | U4.P$AD14 22.07,34.13 21.49,34.7 19.92,34.7 19.71,34.5 19.71,33.72 | 19.71,33.72 v19.71,33.32 v19.72,33.31 19.72,34.1 IC3.8 | U4.P$AD23 21.12,30.02 | U4.P$A22 30.55,32.13 v31.14,32.72 30.45,32.03 C21.1 | v17.5,46.89 17.5,45.46 R3.2 | v13.04,29.85 15.73,29.85 16.06,29.51 v18.12,29.51 18.21,29.42 20.53,29.42 21.12,30.02 | 31.57,14.54 31.53,14.5 C18.1 31.16,13.91 31.07,13.91 | C16.2 20.63,30.51 21.12,30.02 | C20.2 18.56,33.72 19.71,33.72
  Top 0.305: 28.93,37.71 28.93,39.06 28.92,39.07
  Top 0.406: SW2.B' 33.85,24.42 | 33.85,24.42 v36.48,24.42 SW2.B | v10.68,25.35 11.47,25.35 SW1.B' SW1.B | v10.68,25.35 9.82,25.35 5.96,25.35 v5.89,25.28 | v21.85,11.71 U3.5 | 32.42,15.96 IC4.16 IC4.15 | IC4.15 IC4.14 | 30.57,15.6 IC4.14 | 33.63,22.12 32.95,21.45 32.95,20.28 31.57,18.89 | 33.85,22.19 33.85,24.42 | R2.2 32.93,15.94 | IC4.8 IC4.14 | v32.51,36.69 32.51,36.99 31.89,37.62 C24.1 32.26,37.91 34.43,40.08 34.43,42.99 3V3TAP2.P$1 | 31.07,13.91 29.85,12.7 v29.85,12.51 30.12,12.24 30.62,11.75 30.62,10.3 29.79,9.47 C8.1 | 31.57,14.54 IC4.15 | Q1.2 10.7,28.35 10.71,28.34 10.71,26.14 10.68,26.1 v10.68,25.35
  Bottom 0.254: v19.72,33.31 19.36,33.67 17.45,33.67 16.71,32.93 16.71,30.75 17.95,29.51 v18.12,29.51 | 32.51,32.51 32.52,32.51 32.69,32.51 | v26.97,41.58 26.54,42.01 19.62,42.01 17.5,44.13 v17.5,46.89 | v13.04,29.85 12.77,29.85 10.68,27.75 v10.68,25.35 10.68,22.92 11.19,22.42 11.19,17.46 17.4,11.25 21.39,11.25 v21.85,11.71
  Bottom 0.406: v32.51,36.69 32.69,36.51 32.69,32.51 | 32.51,32.51 32.5,32.5 31.35,32.5 v31.14,32.72 | v5.89,25.28 | v5.89,25.28 2.99,25.28 2.87,25.4 3.3VTAP.P$1 | 32.52,32.51 33.6,31.43 33.6,28.95 34.15,28.41 35,28.41 36.27,27.14 36.27,24.63 v36.48,24.42 | v29.85,12.51 29.06,11.71 v21.85,11.71
!RESET  (via drill 0.3 pad 0.25, 0.4)
  Top 0.203: 27.47,26.87 RESET.A' | U4.P$AC13 23.64,34.38 23.81,34.54 v24.04,34.54
  Top 0.254: 27.47,26.87 v25.36,26.87 23.4,26.87 RESET.A
  Bottom 0.203: TP3.P$1 16.93,29.24 16.93,29.59 | v24.04,34.54 20.47,34.54 19.94,35.08 17.95,35.08 17.83,34.95 17.83,34.94
  Bottom 0.254: 17.83,34.94 16.19,33.3 16.19,29.76 16.93,29.03 | 16.93,29.59 16.93,29.03 | 16.93,29.03 16.93,28.3 18.4,26.82 25.23,26.82 25.28,26.87 v25.36,26.87
A1
  Top 0.203: 45.2,30.71 42.35,33.55 38.59,33.55 37.41,34.73 29.64,34.73 29.54,34.63 U4.P$A12
  Top 0.254: R11.1 45.2,20.57 | 45.2,20.57 47,18.77 47,17.7 D6.P$1 | 45.2,20.57 45.2,30.71
A2
  Top 0.203: 43.09,37.45 42.85,37.69 38.51,37.69 37.6,36.78 37.6,35.46 37.34,35.2 29.3,35.2 U4.P$A10
  Top 0.254: 43.09,37.45 45.1,35.44 | 45.1,35.44 IO9.P$1 | R9.1 43.8,34.14 45.1,35.44
A3  (via drill 0.3 pad 0.25, 0.39 pad 0.25)
  Top 0.203: U4.P$B13 28.67,34.32 28.43,34.32 28.08,33.96 v28,33.96 | 37.59,37.71 34.51,37.71 34.26,37.96 v34.15,37.96
  Top 0.254: 37.59,37.71 38.63,38.75 R8.1 41.62,38.75 IO10.P$1
  Bottom 0.178: v28,33.96 28.2,33.77 29.3,33.77
  Bottom 0.203: 29.3,33.77 30.25,34.72 30.25,37.72 31.99,39.46 32.49,39.46 33.99,37.96 v34.15,37.96
A4/SCL  (via drill 0.39 pad 0.25)
  Top 0.203: v26.92,39.92 26.86,39.85 26.86,38.46 26.73,38.33 U4.P$J1
  Top 0.254: SCL.P$1 8.01,39.88 10.88,39.88 R13.1
  Bottom 0.254: v26.92,39.92 26.15,40.69 8.04,40.69 SCL.P$1
A5/SDA  (via drill 0.3 pad 0.25)
  Top 0.203: U4.P$K2 v26.48,36.58 | R14.1 4.03,33.32 SDA.P$1
  Bottom 0.203: v26.48,36.58 24.48,38.58 17.95,38.58 16.76,39.77 14.03,39.77 7.59,33.32
  Bottom 0.254: 7.59,33.32 SDA.P$1
D0/A6/RX  (via drill 0.3)
  Top 0.178: U4.P$B9 28.65,35.46 28.56,35.46 28.31,35.71 28.31,36.45 28.07,36.69 27.39,36.69 v27.16,36.46
  Top 0.254: RX.P$1 4,17.23 4.11,17.35 6.39,17.35 R15.1
  Bottom 0.203: 7.27,30.76 14.69,38.17 24.14,38.17 26.25,36.07 26.77,36.07 v27.16,36.46
  Bottom 0.254: RX.P$1 3.26,16.83 4.64,16.83 7.27,19.46 7.27,30.76
D1/TX  (via drill 0.3 pad 0.25)
  Top 0.203: v23.86,35.94 23.73,35.94 23.23,35.44 U4.P$AC9
  Top 0.254: TX.P$1 8.49,10.83 R16.1
  Bottom 0.203: 8.97,28.13 17.2,36.37 21.51,36.37 22.13,35.74 23.66,35.74 v23.86,35.94
  Bottom 0.254: TX.P$1 8.97,11.31 8.97,28.13
D4_LEFTBUTTON
  Top 0.178: U4.P$W24 24.23,31.02 23.87,30.66 22.96,30.66
  Top 0.203: 18.3,28.42 SW1.A 19.03,27.99 20.29,27.99 22.96,30.66
  Top 0.254: SW1.A' 18.3,28.42
D5_RIGHTBUTTON
  Top 0.203: SW2.A 38.54,28.54 38.54,32.92 37.13,34.34 29.83,34.34 29.63,34.13 U4.P$A14
  Top 0.254: SW2.A' 32.22,26.89 33.08,26.03 37.31,26.03 38.42,27.14 SW2.A
D7_SLIDESWITCH  (via drill 0.4)
  Top 0.178: 23.36,29.82 24.06,29.82 25.23,30.99 U4.P$R24
  Top 0.203: v15.69,26.75 15.98,27.04 15.98,27.05 20.59,27.05 23.36,29.82
  Top 0.254: SWITCH.P1 25.17,18.94 25.17,15.79 v25.22,15.74 25.22,13.77 SWITCH.P2
  Bottom 0.254: v15.69,26.75 15.69,26.67 15.49,26.47 15.49,18.62 18.74,15.37 24.95,15.37 25.22,15.63 v25.22,15.74
D8_NEOPIX
  Top 0.203: LED6.1 19.3,41.2 20.98,41.2 21.19,40.99 21.19,36.81 22.37,35.63 U4.P$AD8
D11_SPEAKERSD  (via drill 0.4)
  Top 0.178: U4.P$U24 24.73,31 23.99,30.25 23.15,30.25
  Top 0.203: v12.8,26.95 13.36,27.51 20.41,27.51 23.15,30.25 | v12.71,18.15 12.07,18.15 10.68,19.54 IC2.4
  Top 0.254: R10.1 9.79,19.97 IC2.4
  Bottom 0.203: v12.8,26.95 12.54,26.7 12.54,18.31 v12.71,18.15
D12/SPEAKER  (via drill 0.4)
  Top 0.203: v27.84,38.35 v27.85,38.35 27.23,37.73 U4.P$G1 | R12.1 40.46,13.05 42.8,10.72
  Top 0.254: v19.7,13.61 C9.1 | 42.8,10.72 43.05,10.47 IO12.P$1
  Bottom 0.254: v27.84,38.35 27.89,38.3 28.75,38.3 31.15,40.7 33.47,40.7 35.77,38.39 35.77,32.44 43.09,25.11 43.09,22.07 35.28,14.25 35.28,13.88 | v19.7,13.61 19.98,13.88 35.28,13.88 | IO12.P$1 40.78,12.89 36.27,12.89 35.28,13.88
D13_LED  (via drill 0.3 pad 0.25, 0.39 pad 0.25)
  Top 0.178: v28.21,33.18 28.31,33.28 28.31,33.56 28.6,33.85 28.71,33.85
  Top 0.203: 33.92,40.56 32.25,38.89 v32.23,38.89 | 28.71,33.85 U4.P$B15
  Top 0.254: R5.1 33.36,43.04 33.92,42.48 33.92,40.56
  Bottom 0.178: 29.29,33.18 v28.21,33.18
  Bottom 0.203: v32.23,38.89 32.03,38.89 30.63,37.49 30.63,34.52 29.29,33.18
D24_LISIRQ  (via drill 0.39)
  Top 0.203: v37.57,27.29 37.47,27.29 37.09,27.67 37.09,29.13 38.1,30.14 38.1,32.77 36.98,33.89 30.04,33.89 29.78,33.63 U4.P$A16
  Top 0.254: v28.97,16.45 28.97,16.51 29.41,16.96 IC4.11
  Bottom 0.254: v37.57,27.29 39,25.86 39,21.51 36.51,19.03 36.51,17.58 34.46,15.53 29.88,15.53 v28.97,16.45
D+
  Top 0.203: U4.P$AD6 22.45,36.13 21.62,36.97 21.62,43.4 22.66,44.45 25.21,44.45 25.36,44.6 25.36,45.4 CN1.D+
D-
  Top 0.203: U4.P$AD4 22.56,36.63 22.03,37.16 22.03,40.17 22.03,43.16 22.88,44.01 25.65,44.01 26.01,44.36 26.01,45.4 CN1.D-
DEC1
  Top 0.203: 28.45,39.74 28.45,37.97 28.23,37.76 U4.P$C1
  Top 0.254: C7.2 28.14,39.74 28.45,39.74
DEC3
  Top 0.178: C14.1 29.52,30.06 28.87,30.71 28.44,30.71 28.26,30.89 28.26,31.29 27.98,31.57 U4.P$D23
DEC4_6  (via drill 0.35)
  Top 0.178: U4.P$E24 27.83,31.03 27.83,30.82 28.3,30.35 28.69,30.35 29.75,29.3
  Top 0.203: C25.1 29.59,39.64 29.59,37.01 | U4.P$B5 28.76,36.4 28.88,36.4 29.49,37.01 29.59,37.01 | v34.54,29.1 33.79,29.1 33.59,29.3 29.75,29.3 | 29.59,37.01 30.06,37.01 30.77,36.3 v31.83,36.3
  Bottom 0.203: v31.83,36.3 31.85,36.32 31.85,36.88 32.36,37.39 32.7,37.39 33.38,36.7 33.38,32.47 34.11,31.74 34.11,29.53 v34.54,29.1
DEC5
  Top 0.203: C15.1 25.73,30.12 U4.P$N24
DECUSB
  Top 0.178: C22.1 23.49,37.43 23.25,37.19 23.25,36.4 U4.P$AC5
GND  (via drill 0.39)
  Top 0.203: 27.48,31.5 27.23,31.25 | U4.P$B7 29.51,36.25
  Top 0.229: U4.P$F23 27.48,31.5 | 29.51,36.25 v29.56,36.25 | 27.23,31.25 27.23,30.82
  Top 0.254: v13.62,26.23 14.13,25.72 18.93,25.72 19.03,25.62 C6.2 20.33,26.04 22.76,28.46 RESET.B | IC4.10 29.42,17.45 29.35,17.53 28.84,17.53 28.08,16.76 27.91,16.93 | IC4.12 29.85,16.46 29.54,16.14 29.54,15.37 29.16,14.99 28.08,14.99 27.91,14.82 SWITCH.S2 | IC1.6 36.21,21.58 IC1.2 35.51,21.38 IC1.7 34.87,20.73 34.87,19.89 34.33,19.35 34.21,19.35 32.92,18.07 IC4.5 32.57,17.95 31.95,17.34 v31.95,17.02 | IC1.5 39.6,20.96 C3.2 | IC1.8 37.49,19.05 37.79,19.05 37.92,18.92 37.92,17.65 38.11,17.46 39.57,17.46 40.21,18.1 40.21,18.79 LED1.4 | 25.98,34.74 U4.THERMPAD | 36.79,32.71 37.17,32.33 | 36.64,30.36 C12.2 36.47,30.16 36.47,29.85 36.19,29.57 v35.93,29.57 35.65,29.84 34.29,29.84 34.28,29.83 33.71,29.83 33.45,30.09 C13.2 | C1.2 28.19,29.85 27.23,30.82 | U4.P$F23 27.44,31.67 27.44,31.92 v27.92,32.41 25.98,34.35 U4.THERMPAD | U4.THERMPAD 24.67,35.69 24.67,36.07 | U4.THERMPAD 24.63,33.03 24.63,32.35
  Top 0.305: SWITCH.S1 27.91,16.93 | C27.2 22.11,45.07 CN1.SPRT@2
  Top 0.406: L.C 31.21,48.13 CN1.SPRT@3 28.91,48.23 CN1.BASE@1 CN1.BASE@2 21.91,48.23 CN1.SPRT@4 19.31,48.13 PWR.C | C5.2 27,10.67 C4.2 27.44,10.35 27.89,9.9 C8.2
  Top 0.508: GNDTAP2.P$1 16.51,7.94 17.66,7.94 v18.42,7.18
  Bottom 0.508: GNDTAP.P$1 44.76,25.4 42.44,27.73 v42.47,27.76
  other vias: 36.6,37.08 30.96,41.47 30.76,39.23 27.02,34.87 24.97,33.39 24.93,35.4 26.98,33.27 16.52,41.47 9.76,34.37 11.39,32.53 11.31,16.38 11.82,21.27 17.36,31.5 21.79,6.54 27.38,8 29.85,7.94 27.94,15.66 34.74,10.29 24.58,28.45 26.3,27.75 30.21,27.67 30.55,24.51 29.47,21.97 31.45,25.64 31.57,22.85 36.65,23.37 36.97,25.39 40.46,26.04 40.84,21.46 38.29,35.65 29.86,28.61 39.7,30.46 23.58,42.81 25.43,42.85 13.38,34.47 9.6,13.14 13.66,11.18 29.47,20.45 32.2,20.76 21.8,31.65 33.11,27.17 34.93,25.26 31.96,30.03 26.29,32.35 15.62,37.17 36.68,39.4 5.97,27.73 8.2,24.6 7.07,17.87 6.05,21.22 27.89,17.34 29.41,18.73 31.39,26.95 18.04,25.97 35.81,18.14 28.94,13.2 26.74,13.14 33.31,12.76 38.8,14.91 42.91,16.07 44.29,19.2 31.26,36.97 16.32,25.34 13.47,31.5 11.62,26.76 32.13,6.88 25.45,9.6 30.98,43.42 20.41,37.05 18.17,37.07 16.58,38.95 38.21,10.41 34.67,8.45 42.05,24.57 41.99,31.19 6.87,31.89 19.17,39.18 34.8,37.07 21.67,13.06 17.44,10.31 34.74,32.86 15.75,15.21
  pour Bottom: 14.74,50.8 14.6,43.08 35.42,43.08 35.57,50.8
  pour Top (isolate 0.254): 25.41,5.08 arc-90 5.09,25.4 arc-90 25.41,45.72 arc-90 45.73,25.4 arc-90
  pour Bottom (isolate 0.254, rank 2): 25.41,5.08 arc-90 5.09,25.4 arc-90 25.41,45.72 arc-90 45.73,25.4 arc-90
LIGHT  (via drill 0.3, 0.4)
  Top 0.203: U4.P$B11 28.57,34.88 27.87,35.57 27.87,36.06 27.8,36.13 v27.8,36.18
  Top 0.254: v17.26,37.57 16.08,36.39 U2.E 16.08,32.98 R4.2
  Bottom 0.203: v27.8,36.18 27.28,35.67 26.09,35.67 23.99,37.77 17.37,37.77 17.26,37.65 v17.26,37.57
LIS_SCL  (via drill 0.3 pad 0.25, 0.4)
  Top 0.178: v28.66,31.7 28.74,31.77 U4.P$B17
  Top 0.254: IC4.4 34,17.45 R2.1 34.18,18.37 34.45,18.65 v34.45,18.69
  Bottom 0.203: 35.73,20.94 35.73,26.89 34.71,27.91 33.96,27.91 33.1,28.77 33.1,31.11 32.51,31.7 v28.66,31.7
  Bottom 0.254: 35.73,20.94 34.45,19.66 v34.45,18.69
LIS_SDA  (via drill 0.39, 0.4)
  Top 0.203: v34.1,26.75 34.12,26.75 36.2,28.83 36.2,28.84 37.64,30.27 37.64,32.6 36.77,33.46 30.28,33.46 29.45,32.63 U4.P$A20
  Top 0.254: IC4.6 32.13,18.3 33.14,19.32 v33.17,19.32 33.92,20.06 R6.1
  Bottom 0.254: v34.1,26.75 34.16,26.68 34.16,21.82 33.17,20.83 v33.17,19.32
N$1
  Top 0.254: PWR.A 19.06,45.54 R3.1
N$2
  Top 0.178: U4.P$H23 26.98,31.6 26.83,31.45 26.83,30.34 27.09,30.07 C1.1 27.68,29.19 28.38,29.19 L2.1
N$3  (via drill 0.4, 0.5)
  Top 0.406: F1.1 18.32,2.39 v18.04,2.67 | D2.C v30.55,4 | v33.41,11.11 32.01,12.51 D1.C
  Bottom 0.406: v18.04,2.67 18.68,2.67 20.08,4.06 30.55,4.06 | v33.41,11.11 33.74,10.78 33.74,7.25 30.55,4.06 | v30.55,4 30.55,4.06
N$6
  Top 0.254: C9.2 15.39,13.6 R1.1
N$7
  Top 0.406: BATT.2 24.41,5 25.03,4.38 27.38,4.38 28.78,5.79 D2.A
N$8  (via drill 0.4)
  Top 0.254: IC2.3 10.47,22.37 v10.47,21.34 | v12.07,14.03 R1.2
  Bottom 0.254: v10.47,21.34 10.47,15.63 v12.07,14.03
N$9
  Top 0.254: IC2.6 16.74,19.97 19.89,16.82 SP1.+
N$10
  Top 0.254: L.A 31.63,45.35 R5.2
N$11
  Top 0.254: LED1.1 38.06,15.37 38.06,14.12 36.32,12.37 36.32,10.98 LED2.3
N$12
  Top 0.254: LED3.1 41.65,23.36 41.65,18.86 LED1.3
N$13  (via drill 0.4)
  Top 0.254: LED2.1 31.45,9.78 v31.06,9.78 | v17.22,9.27 17.83,8.65 LED10.3
  Bottom 0.254: v31.06,9.78 31.25,9.59 31.25,8.22 29.96,6.92 24.01,6.92 21.73,9.21 17.28,9.21 v17.22,9.27
N$14
  Top 0.254: LED6.3 14.46,40.04 14.46,36.52 12.93,34.99 LED7.1
N$15
  Top 0.254: IC2.1 12.58,22.92 13.05,23.39 16.94,23.39 18.29,22.04 SP1.-
N$16
  Top 0.203: LED7.3 8.92,32.26 8.25,31.59 8.25,29.76 7.94,29.44 7.94,28.05 8.83,27.15 LED8.1
N$17
  Top 0.254: LED8.3 7.78,23.65 8.56,22.87 8.56,19.64 8.91,19.29 9.61,19.29 LED9.1
N$18
  Top 0.254: LED9.3 10.67,14.04 11.57,13.15 14.41,13.15 15.63,11.92 LED10.1
N$19
  Top 0.254: LED3.3 43.43,27.96 42.8,28.59 41.17,28.59 40.72,29.04 40.72,31.49 LED4.1
N$20  (via drill 0.4)
  Top 0.254: LED5.1 36.88,38.63 v37.16,38.35 | LED4.3 39.8,35.61 v39.01,36.4
  Bottom 0.254: v39.01,36.4 37.16,38.25 v37.16,38.35
N$22
  Top 0.178: U4.P$A23 29.23,31.51 29.56,31.18 32.38,31.18 32.54,31.34 32.54,32 32.84,32.3 36.12,32.3 36.66,31.75 C12.1 36.59,31.46 36.42,31.63 Y1.3
N$23
  Top 0.203: Y1.1 33.99,30.63 33.42,31.19 C13.1 32.69,30.75 29.41,30.75 29.03,31.13 U4.P$B24
NEOSENSE_SWITCH  (via drill 0.4)
  Top 0.203: U4.P$L1 26.18,37.68 v26.18,38.6 | v8.92,35.67 8.78,35.53 8.78,34.28 9.82,33.24 9.82,32.3 9.79,32.25 8.8,31.27 Q1.1 | R17.1 19.7,40.3 19.23,39.83 18.91,39.83 18.63,39.54 18.1,39.54 v17.6,40.04
  Bottom 0.203: v26.18,38.6 24.56,40.22 17.65,40.22 | 17.65,40.22 13.47,40.22 v8.92,35.67 | v17.6,40.04 17.65,40.08 17.65,40.22
PDM_CLK  (via drill 0.4, 0.4 pad 0.25)
  Top 0.203: v37.21,18.24 36.36,19.08 35.71,19.08 35.42,19.38 35.42,20.04 35.91,20.53 IC1.3 | v20.63,35.35 20.7,35.35 20.84,35.2 21.62,35.2 22.2,34.63 U4.P$AD12
  Bottom 0.203: 14.91,18.25 14.91,32.73 17.66,35.48 20.5,35.48 v20.63,35.35
  Bottom 0.254: 14.91,18.25 18.25,14.91 34.53,14.91 37.21,17.59 v37.21,18.24
PDM_DAT  (via drill 0.3 pad 0.25, 0.4)
  Top 0.203: v38.81,18.99 38.81,19.5 37.78,20.53 IC1.4 | U4.P$AC11 23.59,34.88 23.73,35.03 23.75,35.03 v23.95,35.23
  Bottom 0.203: v23.95,35.23 21.8,35.23 21.08,35.95 17.47,35.95 14.42,32.91 14.42,29.21
  Bottom 0.254: 14.42,29.21 14.42,17.97 17.98,14.41 34.74,14.41 38.81,18.48 v38.81,18.99
QSPI_CS
  Top 0.203: IC3.1 19.71,32.02 19.33,32.4 19.33,32.81 17.66,32.81 17.66,34.66 18.96,35.96 21.46,35.96 22.28,35.13 U4.P$AD10
QSPI_DATA0  (via drill 0.3 pad 0.25, 0.4 pad 0.25)
  Top 0.203: U4.P$AC17 23.26,33.35 23.88,33.35 v24.01,33.22 | v21.76,33.38 21.76,33.54 21.21,34.09 IC3.5
  Bottom 0.203: v24.01,33.22 24.01,33.27 23.94,33.35 21.81,33.35 21.77,33.38 v21.76,33.38
QSPI_DATA1  (via drill 0.3 pad 0.25, 0.39 pad 0.25)
  Top 0.203: v23.89,32.51 23.52,32.88 U4.P$AC19 | v20.2,32.44 20.21,32.42 IC3.2
  Bottom 0.203: v23.89,32.51 23.61,32.79 20.36,32.79 20.2,32.62 v20.2,32.44
QSPI_DATA2
  Top 0.203: U4.P$AD22 22.43,32.13 22.27,32.28 20.92,32.28 20.71,32.07 IC3.3
QSPI_DATA3
  Top 0.203: U4.P$AD18 22.38,33.13 21.97,32.72 20.74,32.72 20.33,33.13 20.33,33.59 20.21,33.71 IC3.7
QSPI_SCK  (via drill 0.3 pad 0.25, 0.4 pad 0.25)
  Top 0.203: v20.94,33.38 20.94,33.53 20.71,33.76 IC3.6 | v23.81,33.88 v23.8,33.88 U4.P$AC15
  Bottom 0.203: v20.94,33.38 20.94,33.43 21.5,33.99 23.71,33.99 v23.81,33.88
RF
  Top 0.203: L1.2 C11.1
  Top 0.508: X1.FP 29.16,23.23 C11.1
RF1
  Top 0.254: C10.1 29.49,25.5
  Top 0.508: 29.49,25.5 L1.1 | L2.2 29.43,26.96 C17.1 29.42,25.57 C10.1
SWCLK  (via drill 0.3 pad 0.25)
  Top 0.203: U4.P$AA24 23.73,31.27 23.33,31.67 v23.33,31.73
  Bottom 0.203: v23.33,31.73 21.78,30.18 21.78,29.57 21.9,29.44 TP1.P$1
SWDIO  (via drill 0.39 pad 0.25)
  Top 0.203: U4.P$AC24 22.85,31.13 20.39,28.68 20.11,28.68 v20.11,28.64
  Bottom 0.203: v20.11,28.64 19.63,28.64 TP2.P$1
TEMP_SENSE
  Top 0.254: U4.P$A8 33.35,35.63 33.58,35.86 THM1.1 34.8,36.01 R7.2
V+  (via drill 0.4)
  Top 0.229: 37.77,21.38 38.49,22.1
  Top 0.254: 10.3,13.58 9.64,14.72 9.66,14.8 9.66,14.86 10.27,15.47 10.27,16.24 9.66,16.84 | LED2.2 32.79,8.91 v32.2,8.32 | THM1.2 33.52,37.32 33.52,38.43 34.55,39.46 34.58,39.51 34.6,39.51 35.23,40.14 LED5.2 | 12.19,32.8 12.91,32.8 13.3,32.8
  Top 0.305: IC1.1 37.77,21.38 | 38.49,22.1 38.82,22.43 C3.1 40.33,22.94 40.33,24.64 41.16,25.46 44.4,25.46 | LED5.2 35.87,40.5 | LED9.2 8.62,17.59 5.13,21.08 | C2.1 12.91,32.8 | C27.1 18.72,43.01 LED6.2
  Top 0.406: 5.13,21.08 5.13,26.01 5.32,26.2 6.44,26.2 LED8.2 7.26,27.15 7.26,26.91 8.08,26.09 9.84,26.09 10.1,26.35 10.1,27.72 9.75,28.06 Q1.3 11.24,30.85 12.19,31.8 12.19,32.8 | 10.3,13.58 11.25,12.64 13.86,12.64 15.33,11.17 LED10.2 15.12,10.2 v15.12,9.27 | 35.87,40.5 v37.04,41.67 | LED2.2 33.33,9.27 35.95,9.27 37.16,10.48 37.16,12.07 39.13,14.04 39.22,14.15 39.24,14.15 LED1.2 40.72,15.32 43.31,17.91 43.31,18.68 42.18,19.8 42.18,21.97 43.43,23.22 LED3.2 44.4,24.36 44.4,25.46 44.4,29.39 C26.1 43.9,30.69 v43.18,31.41 43.18,31.43 LED4.2 | 9.66,16.84 LED9.2 | LED6.2 17.38,42.36 14.12,42.36 12.61,40.84 12.61,39.8 13.17,39.24 13.17,38.36 LED7.2 10.53,35.73 10.53,34.19 11.34,33.39 11.75,33.39 12.34,32.8 13.3,32.8 13.3,33.07 U2.C
  Bottom 0.406: v37.04,41.67 41.67,37.05 41.67,32.92 v43.18,31.41 | v15.12,9.27 15.88,9.27 16.58,8.57 21.5,8.57 23.71,6.36 30.25,6.36 v32.2,8.32
VBUS  (via drill 0.39, 0.4)
  Top 0.254: U4.P$AD2 22.48,37.38 22.48,42.88 23.16,43.56 26.25,43.56 | CN1.VBUS 26.66,45.4 26.66,44.12 | 26.25,43.71 26.27,43.74 26.66,44.12 | C19.1 27.35,43.43 26.66,44.12
  Top 0.406: 26.25,43.71 26.25,43.56 | 26.27,43.74 v26.33,43.68 | D1.A 36.39,14.36 v36.4,14.35
  Bottom 0.406: v26.33,43.68 28.74,43.68 30.19,42.23 35.42,42.23 40.7,36.94 40.7,28.33 43.89,25.15 43.89,21.84 v36.4,14.35
VCC  (via drill 0.5)
  Top 0.254: IC2.5 11.63,19.52 12.23,18.92 15.19,18.92 18.3,15.81 18.3,15.49 18.74,15.05 23.5,15.05 24.5,14.06 24.5,11.47
  Top 0.406: F1.2 19.89,7.08 20.9,8.1 U3.1 20.9,10.22 23.44,10.22 | 23.44,10.22 22.8,9.59 U3.3 22.8,5.4 25.54,2.67 v25.54,2.48 | 23.44,10.22 23.89,10.67 C5.1 24.24,11.22 24.5,11.47 25.35,12.32 28.65,12.32 29.34,11.62 C4.1
  Bottom 0.406: v25.54,2.48 25.92,2.1 32.65,2.1 35.83,5.28 VCC2.P$1